# Altium project CPU.PrjPcb (part 1 of 2)
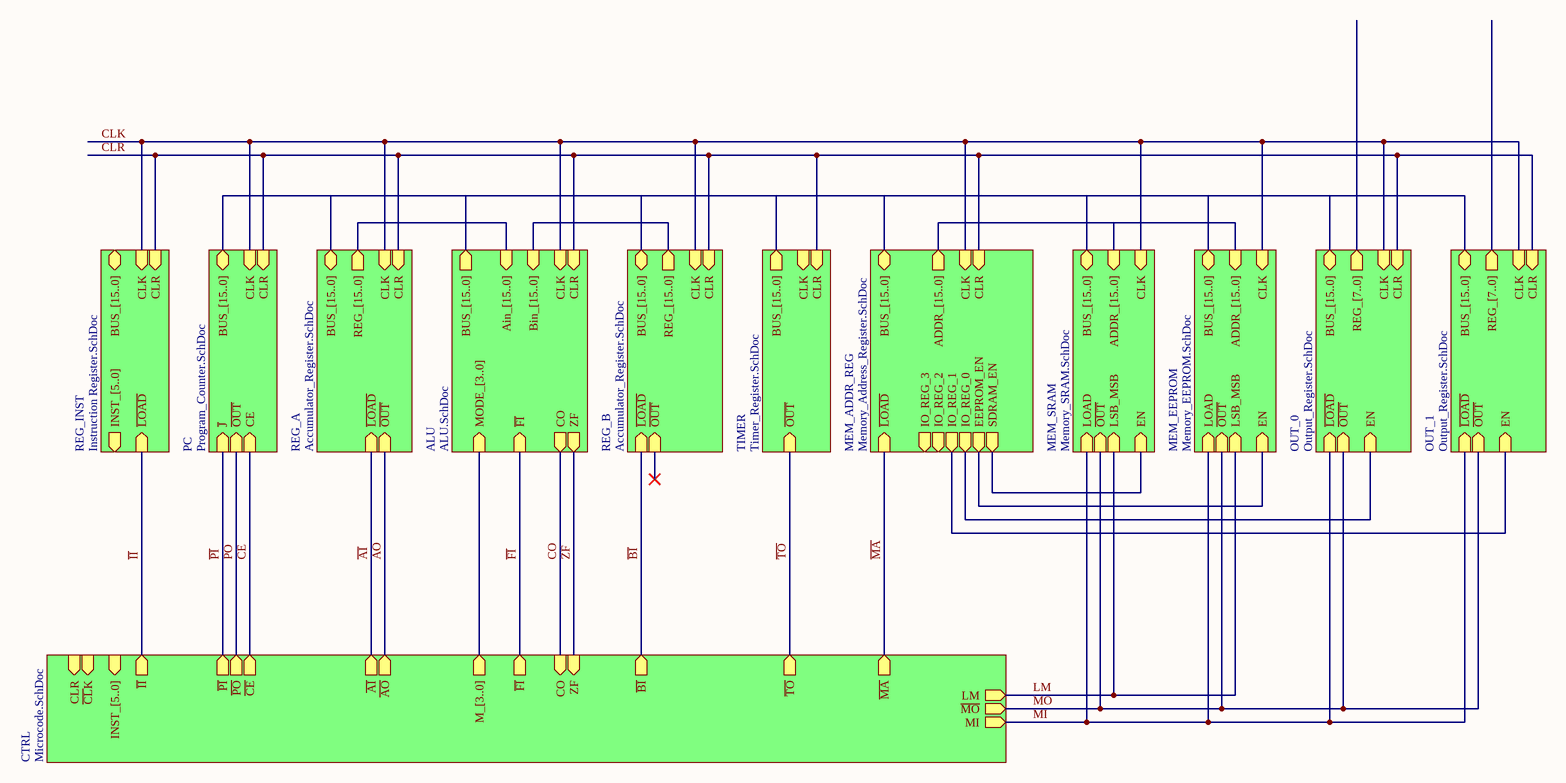
[diagram p0: TOP.SchDoc]
11 sheets, 67 parts. Net scope: hierarchical (ports join the sheet entries above them; power ports are global).
Board file: PCB1.PcbDoc
Sheets:
  TOP.SchDoc
    REG_A = Accumulator_Register.SchDoc
    REG_B = Accumulator_Register.SchDoc
    ALU = ALU.SchDoc
      ALU_ADDER = ALU_Adder.SchDoc
      ALU_AND = ALU_AND.SchDoc
      ALU_OR = ALU_OR.SchDoc
      ALU_XOR = ALU_XOR.SchDoc
      ALU_SHIFTER = ALU_Shifter.SchDoc
      ALU_ZF = ALU_ZF.SchDoc
      ALU_ONES = ALU_ONES.SchDoc
    TIMER = Timer_Register.SchDoc

## Sheet TOP.SchDoc
size B; Author: E. Sims; Organization: Let's Build Rockets Inc.; SheetNumber: 1; SheetTotal: 16

### Sub-sheets
ALU = ALU.SchDoc: MODE_[3..0] (in), BUS_[15..0] (out), Ain_[15..0] (in), Bin_[15..0] (in), CO (out), CLK (in), ~{FI} (in), ZF (out), CLR (in)
CTRL = Microcode.SchDoc (file not in this document): ~{AO} (out), ~{CE} (out), MI (out), ~{MA} (out), ~{FI} (out), ~{PI} (out), ~{AI} (out), ~{II} (out), CLR (in), ~{PO} (out), LM (out), ~{MO} (out), ~{TO} (out), INST_[5..0] (in), ~{CL}K (in), ~{BI} (out), M_[3..0] (out), ZF (in), CO (in)
MEM_ADDR_REG = Memory_Address_Register.SchDoc (file not in this document): CLK (in), CLR (in), ~{LOAD} (in), BUS_[15..0] (bidir), ADDR_[15..0] (out), EEPROM_EN (out), SDRAM_EN (out), IO_REG_2 (out), IO_REG_3 (out), IO_REG_1 (out), IO_REG_0 (out)
MEM_EEPROM = Memory_EEPROM.SchDoc (file not in this document): CLK (in), BUS_[15..0] (bidir), ADDR_[15..0] (in), LOAD (in), LSB_MSB (in), ~{OUT} (in), EN (in)
MEM_SRAM = Memory_SRAM.SchDoc (file not in this document): CLK (in), BUS_[15..0] (bidir), ADDR_[15..0] (in), LOAD (in), LSB_MSB (in), ~{OUT} (in), EN (in)
OUT_0 = Output_Register.SchDoc (file not in this document): ~{LOAD} (in), CLR (in), BUS_[15..0] (bidir), ~{OUT} (in), CLK (in), REG_[7..0] (out), EN (in)
OUT_1 = Output_Register.SchDoc (file not in this document): ~{LOAD} (in), CLR (in), BUS_[15..0] (bidir), ~{OUT} (in), CLK (in), REG_[7..0] (out), EN (in)
PC = Program_Counter.SchDoc (file not in this document): CLK (in), ~{OUT} (in), CLR (in), BUS_[15..0] (bidir), CE (in), ~{J} (in)
REG_A = Accumulator_Register.SchDoc: CLK (in), ~{OUT} (in), CLR (in), ~{LOAD} (in), BUS_[15..0] (bidir), REG_[15..0] (out)
REG_B = Accumulator_Register.SchDoc: CLK (in), ~{OUT} (in), CLR (in), ~{LOAD} (in), BUS_[15..0] (bidir), REG_[15..0] (out)
REG_INST = Instruction Register.SchDoc (file not in this document): CLK (in), CLR (in), BUS_[15..0] (bidir), ~{LOAD} (in), INST_[5..0] (out)
TIMER = Timer_Register.SchDoc: CLK (in), ~{OUT} (in), CLR (in), BUS_[15..0] (out)

### Nets
~{AI}: sheet REG_A/~{LOAD}, sheet CTRL/~{AI}
~{AO}: sheet REG_A/~{OUT}, sheet CTRL/~{AO}
~{BI}: sheet REG_B/~{LOAD}, sheet CTRL/~{BI}
~{CE}: sheet PC/CE, sheet CTRL/~{CE}
CLK: sheet REG_A/CLK, sheet REG_B/CLK, sheet PC/CLK, sheet MEM_ADDR_REG/CLK, sheet MEM_SRAM/CLK, sheet MEM_EEPROM/CLK, sheet ALU/CLK, sheet OUT_0/CLK, sheet REG_INST/CLK, sheet OUT_1/CLK
CLR: sheet REG_A/CLR, sheet REG_B/CLR, sheet PC/CLR, sheet MEM_ADDR_REG/CLR, sheet ALU/CLR, sheet OUT_0/CLR, sheet REG_INST/CLR, sheet TIMER/CLR, sheet OUT_1/CLR
CO: sheet ALU/CO, sheet CTRL/CO
~{FI}: sheet ALU/~{FI}, sheet CTRL/~{FI}
~{II}: sheet REG_INST/~{LOAD}, sheet CTRL/~{II}
LM: sheet MEM_SRAM/LSB_MSB, sheet MEM_EEPROM/LSB_MSB, sheet CTRL/LM
~{MA}: sheet MEM_ADDR_REG/~{LOAD}, sheet CTRL/~{MA}
~{MO}: sheet MEM_SRAM/~{OUT}, sheet MEM_EEPROM/~{OUT}, sheet OUT_0/~{OUT}, sheet CTRL/~{MO}, sheet OUT_1/~{OUT}
MI: sheet MEM_SRAM/LOAD, sheet MEM_EEPROM/LOAD, sheet OUT_0/~{LOAD}, sheet CTRL/MI, sheet OUT_1/~{LOAD}
~{PI}: sheet PC/~{J}, sheet CTRL/~{PI}
~{PO}: sheet PC/~{OUT}, sheet CTRL/~{PO}
~{TO}: sheet CTRL/~{TO}, sheet TIMER/~{OUT}  [project net ~{OUT}]
ZF: sheet ALU/ZF, sheet CTRL/ZF
(unnamed): sheet MEM_ADDR_REG/EEPROM_EN, sheet MEM_EEPROM/EN
(unnamed): sheet MEM_ADDR_REG/SDRAM_EN, sheet MEM_SRAM/EN
(unnamed): sheet MEM_ADDR_REG/IO_REG_1, sheet OUT_1/EN
(unnamed): sheet MEM_ADDR_REG/IO_REG_0, sheet OUT_0/EN

### Buses and harness runs
bus sheet ALU/Ain_[15..0] = sheet REG_A/REG_[15..0]
bus sheet ALU/Bin_[15..0] = sheet REG_B/REG_[15..0]
bus sheet ALU/BUS_[15..0] = sheet MEM_ADDR_REG/BUS_[15..0] = sheet MEM_EEPROM/BUS_[15..0] = sheet MEM_SRAM/BUS_[15..0] = sheet OUT_0/BUS_[15..0] = sheet OUT_1/BUS_[15..0] = sheet PC/BUS_[15..0] = sheet REG_A/BUS_[15..0] = sheet REG_B/BUS_[15..0] = sheet TIMER/BUS_[15..0]
bus sheet ALU/MODE_[3..0] = sheet CTRL/M_[3..0]
bus sheet MEM_ADDR_REG/ADDR_[15..0] = sheet MEM_EEPROM/ADDR_[15..0] = sheet MEM_SRAM/ADDR_[15..0]

### Notes on the sheet
- Let's Build Rocket's Inc. Modular Paylaod System Based on TMP-010 Rev
  For more information visit https://github.com/LetsBuildRockets/Modular-Payload-System
  This work is licensed under CC BY-NC 4.0. To view a copy of this license, visit https://creativecommons.org/licenses/by-nc/4.0
- Title
- Size:
- Date:
- Assembly Variant:
- B
- Number:
- Time:
- Revision:
- Sheet
- of
- Author:
- File:

## Sheet Accumulator_Register.SchDoc
size B; Author: E. Sims; Organization: Let's Build Rockets Inc.; SheetNumber: 2; SheetTotal: 16
Used 2 times, as channels REG_A, REG_B. Parts and nets are listed once, with the designators drawn on the sheet.
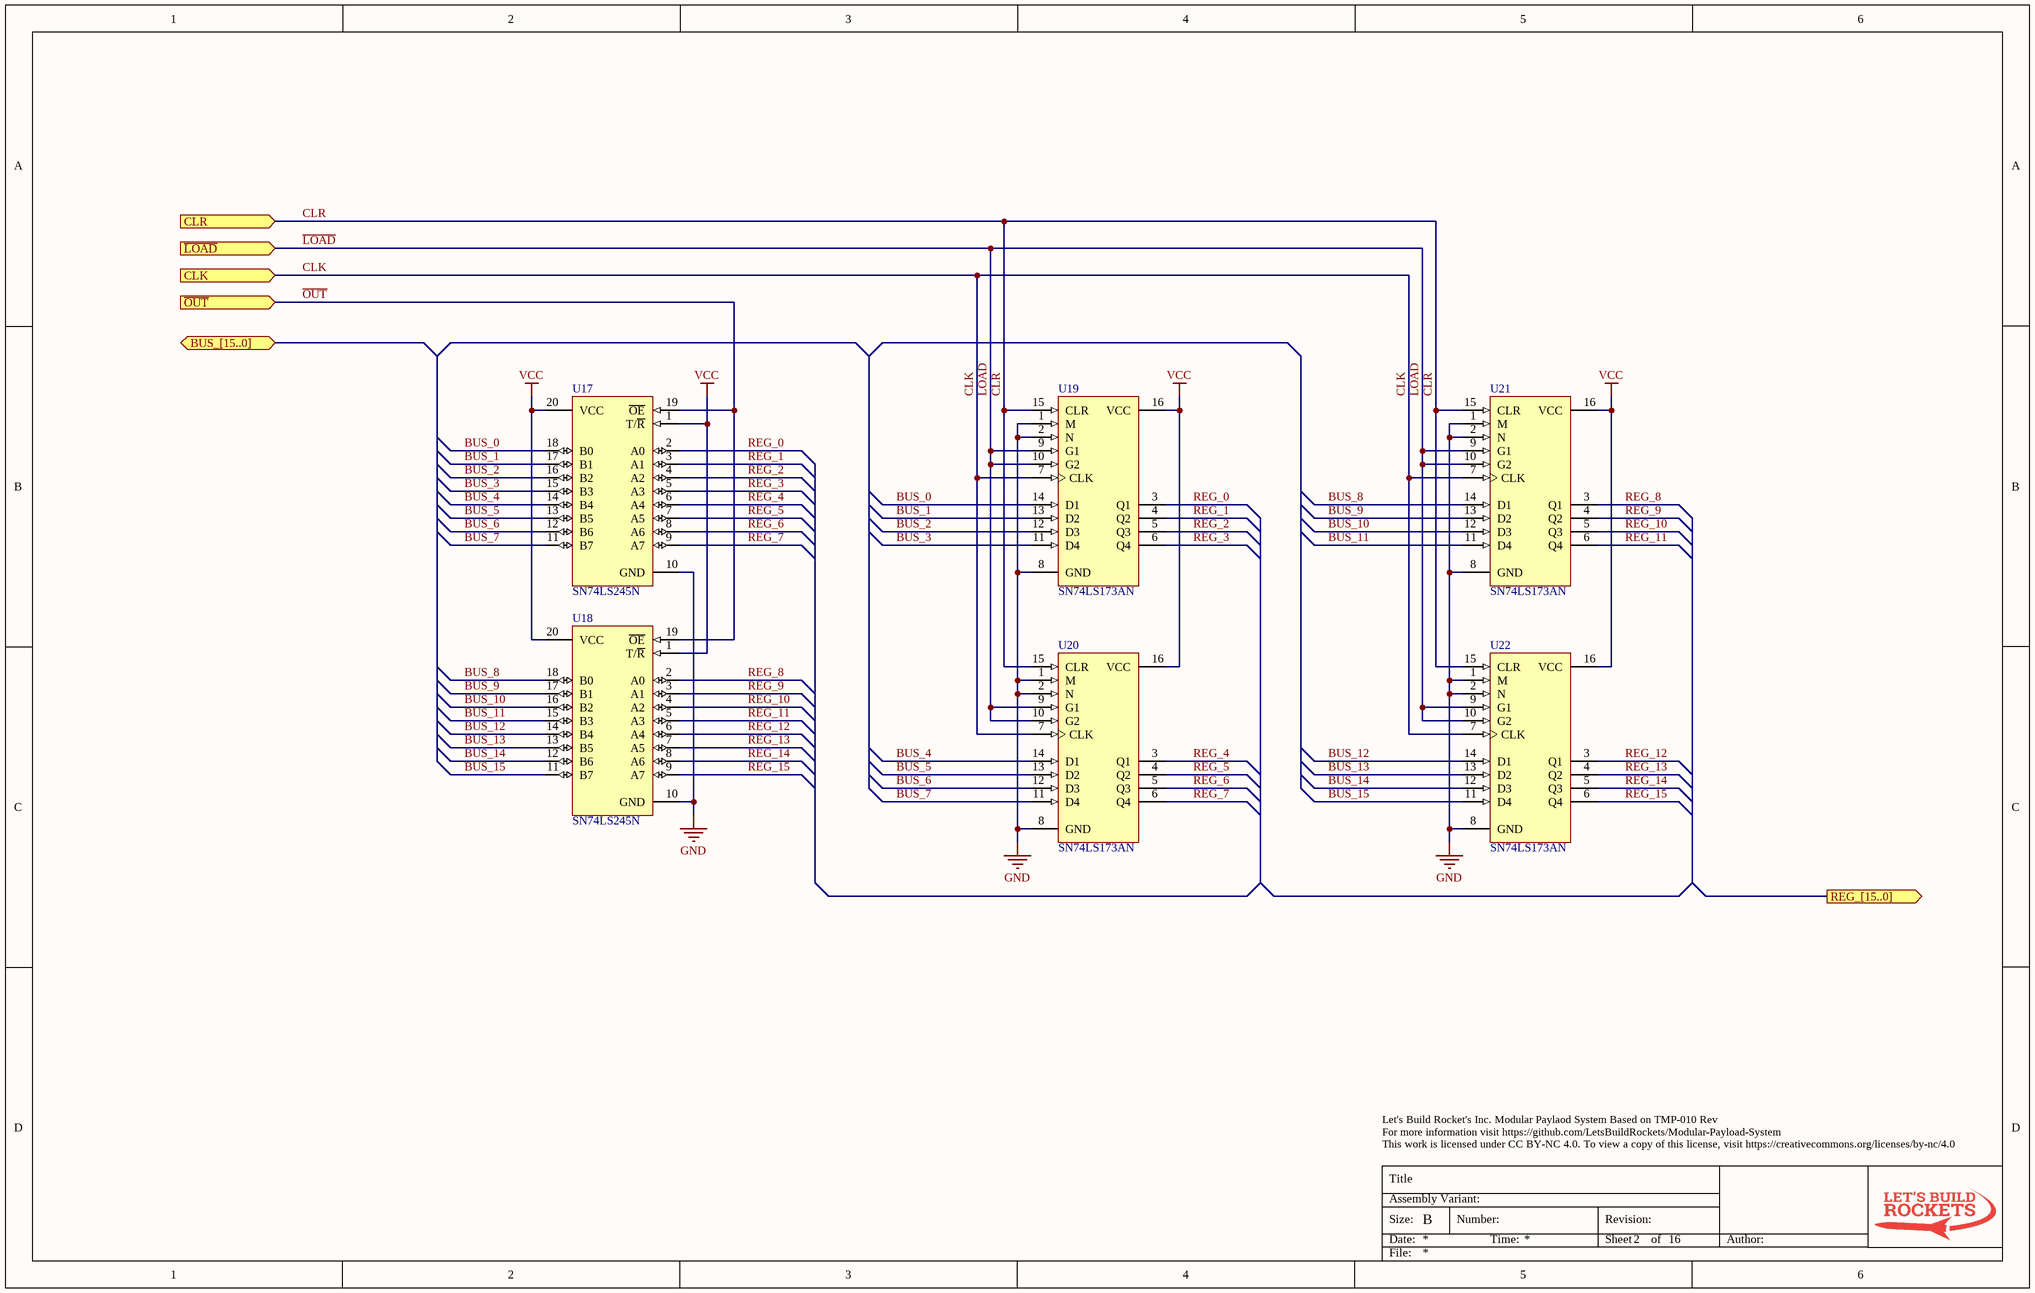
[diagram p1: Accumulator_Register.SchDoc]

### Parts
U17  SN74LS245N  [N020]
U18  SN74LS245N  [N020]
U19  SN74LS173AN  [N016D]
U20  SN74LS173AN  [N016D]
U21  SN74LS173AN  [N016D]
U22  SN74LS173AN  [N016D]

### Ports
BUS_[15..0] (bidir), CLK (in), CLR (in), REG_[15..0] (out), ~{LOAD} (in), ~{OUT} (in)

### Nets
GND: U17.10(GND) U18.10(GND) U19.1(M) U19.2(N) U19.8(GND) U20.1(M) U20.2(N) U20.8(GND) U21.1(M) U21.2(N) U21.8(GND) U22.1(M) U22.2(N) U22.8(GND)
VCC: U17.1(T/~{R}) U17.20(VCC) U18.1(T/~{R}) U18.20(VCC) U19.16(VCC) U20.16(VCC) U21.16(VCC) U22.16(VCC)
BUS_0: U17.18(B0) U19.14(D1)
BUS_1: U17.17(B1) U19.13(D2)
BUS_2: U17.16(B2) U19.12(D3)
BUS_3: U17.15(B3) U19.11(D4)
BUS_4: U17.14(B4) U20.14(D1)
BUS_5: U17.13(B5) U20.13(D2)
BUS_6: U17.12(B6) U20.12(D3)
BUS_7: U17.11(B7) U20.11(D4)
BUS_8: U18.18(B0) U21.14(D1)
BUS_9: U18.17(B1) U21.13(D2)
BUS_10: U18.16(B2) U21.12(D3)
BUS_11: U18.15(B3) U21.11(D4)
BUS_12: U18.14(B4) U22.14(D1)
BUS_13: U18.13(B5) U22.13(D2)
BUS_14: U18.12(B6) U22.12(D3)
BUS_15: U18.11(B7) U22.11(D4)
CLK: U19.7(CLK) U20.7(CLK) U21.7(CLK) U22.7(CLK) ; port CLK
CLR: U19.15(CLR) U20.15(CLR) U21.15(CLR) U22.15(CLR) ; port CLR
~{LOAD}: U19.9(G1) U19.10(G2) U20.9(G1) U20.10(G2) U21.9(G1) U21.10(G2) U22.9(G1) U22.10(G2) ; port ~{LOAD}
~{OUT}: U17.19(~{OE}) U18.19(~{OE}) ; port ~{OUT}
REG_0: U17.2(A0) U19.3(Q1)
REG_1: U17.3(A1) U19.4(Q2)
REG_2: U17.4(A2) U19.5(Q3)
REG_3: U17.5(A3) U19.6(Q4)
REG_4: U17.6(A4) U20.3(Q1)
REG_5: U17.7(A5) U20.4(Q2)
REG_6: U17.8(A6) U20.5(Q3)
REG_7: U17.9(A7) U20.6(Q4)
REG_8: U18.2(A0) U21.3(Q1)
REG_9: U18.3(A1) U21.4(Q2)
REG_10: U18.4(A2) U21.5(Q3)
REG_11: U18.5(A3) U21.6(Q4)
REG_12: U18.6(A4) U22.3(Q1)
REG_13: U18.7(A5) U22.4(Q2)
REG_14: U18.8(A6) U22.5(Q3)
REG_15: U18.9(A7) U22.6(Q4)

### Channels
REG_A: designators end in _REG_A; ports CLK=CLK CLR=CLR ~{LOAD}=~{AI} ~{OUT}=~{AO}
REG_B: designators end in _REG_B; ports CLK=CLK CLR=CLR ~{LOAD}=~{BI} ~{OUT}=~{OUT}_REG_B

### Notes on the sheet
- Let's Build Rocket's Inc. Modular Paylaod System Based on TMP-010 Rev
  For more information visit https://github.com/LetsBuildRockets/Modular-Payload-System
  This work is licensed under CC BY-NC 4.0. To view a copy of this license, visit https://creativecommons.org/licenses/by-nc/4.0
- Title
- Size:
- Date:
- Assembly Variant:
- B
- Number:
- Time:
- Revision:
- Sheet
- of
- Author:
- File:

### Library data of the parts
U17 U18 = SN74LS245N: Octal Bus Transceiver with 3-State Outputs; Published: 8-Jun-2000; LatestRevisionDate: 04-Mar-2005; LatestRevisionNote: Stylized 3D Model Added.; DatasheetVersion: Mar-1988; PackageVersion: Oct-1995; PackageReference: N020; Publisher: Altium Limited; PackageDescription: DIP; 20 Leads; Row Spacing 7.62 mm; Pitch 2.54 mm; ComponentLink1Description: Manufacturer Link; ComponentLink1URL: http://www.ti.com/; ComponentLink2Description: Datasheet; ComponentLink2URL: http://www-s.ti.com/sc/ds/sn74ls245.pdf
U19-U22 = SN74LS173AN: 4-Bit D-Type Register with 3-State Outputs; Published: 8-Jun-2000; LatestRevisionDate: 04-Mar-2005; LatestRevisionNote: Stylized 3D Model Added.; DatasheetVersion: Mar-1988; PackageVersion: Oct-1995; PackageReference: N016D; Publisher: Altium Limited; PackageDescription: DIP; 16 Leads; Row Spacing 7.62 mm; Pitch 2.54 mm; Code_JEDEC: MS-001-BB; ComponentLink1Description: Manufacturer Link; ComponentLink1URL: http://www.ti.com/; ComponentLink2Description: Datasheet; ComponentLink2URL: http://www-s.ti.com/sc/ds/sn74ls173a.pdf

## Sheet ALU.SchDoc
size B; Author: E. Sims; Organization: Let's Build Rockets Inc.; SheetNumber: 4; SheetTotal: 11
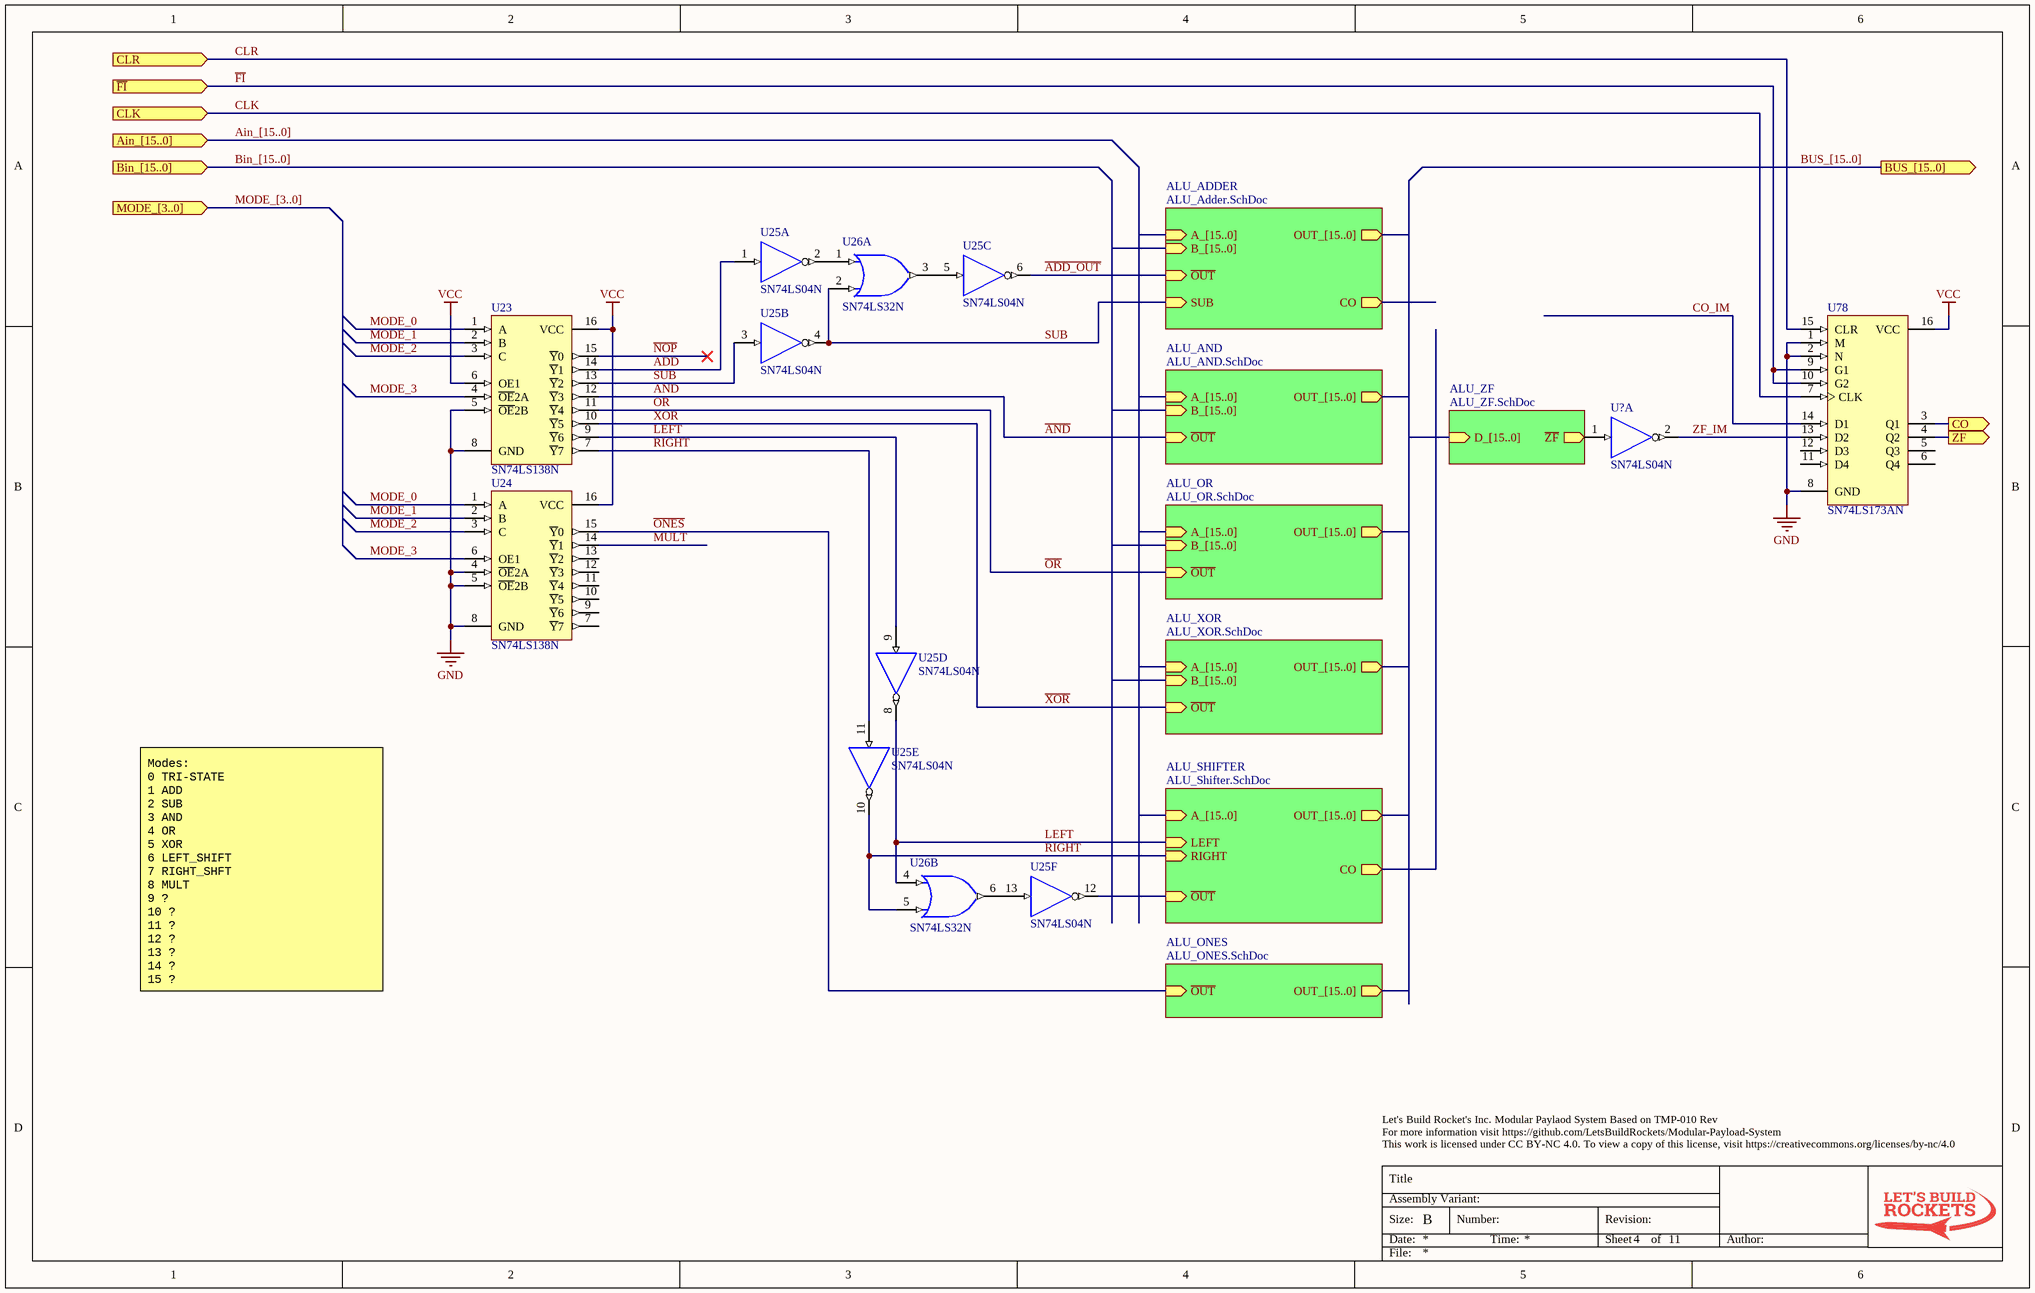
[diagram p2: ALU.SchDoc]

### Parts
(Parts that share a designator on the sheet are numbered #1, #2 ... from top to bottom, then left to right.)
U23  SN74LS138N  [N016]
U24  SN74LS138N  [N016]
U25#1  SN74LS04N  [N014]  (parts A,B,C,D,E,F of 6)
U25#2  SN74LS04N  [N014]  (part A of 6)
U26  SN74LS32N  [N014]  (parts A,B of 4)
U78  SN74LS173AN  [N016D]

### Sub-sheets
ALU_ADDER = ALU_Adder.SchDoc: B_[15..0] (in), ~{OUT} (in), OUT_[15..0] (out), SUB (in), A_[15..0] (in), CO (out)
ALU_AND = ALU_AND.SchDoc: B_[15..0] (in), ~{OUT} (in), OUT_[15..0] (out), A_[15..0] (in)
ALU_ONES = ALU_ONES.SchDoc: ~{OUT} (in), OUT_[15..0] (out)
ALU_OR = ALU_OR.SchDoc: B_[15..0] (in), ~{OUT} (in), OUT_[15..0] (out), A_[15..0] (in)
ALU_SHIFTER = ALU_Shifter.SchDoc: ~{OUT} (in), OUT_[15..0] (out), A_[15..0] (in), CO (out), LEFT (in), RIGHT (in)
ALU_XOR = ALU_XOR.SchDoc: B_[15..0] (in), ~{OUT} (in), OUT_[15..0] (out), A_[15..0] (in)
ALU_ZF = ALU_ZF.SchDoc: D_[15..0] (in), ~{ZF} (out)

### Ports
Ain_[15..0] (in), Bin_[15..0] (in), BUS_[15..0] (out), CLK (in), CLR (in), CO (out), MODE_[3..0] (in), ZF (out), ~{FI} (in)

### Nets
GND: U23.5(~{OE}2B) U23.8(GND) U24.4(~{OE}2A) U24.5(~{OE}2B) U24.8(GND) U25#1.7(GND) U25#2.7(GND) U26.7(GND) U78.1(M) U78.2(N) U78.8(GND)
VCC: U23.6(OE1) U23.16(VCC) U24.16(VCC) U25#1.14(VCC) U25#2.14(VCC) U26.14(VCC) U78.16(VCC)
~{ADD}: U23.14(~{Y}1) U25#1.1(A)
~{ADD_OUT}: U25#1.6(Y) ; sheet ALU_ADDER/~{OUT}
~{AND}: U23.12(~{Y}3) ; sheet ALU_AND/~{OUT}
CLK: U78.7(CLK) ; port CLK
CLR: U78.15(CLR) ; port CLR
CO: U78.3(Q1) ; port CO
CO_IM: U78.14(D1)
~{FI}: U78.9(G1) U78.10(G2) ; port ~{FI}
~{LEFT}: U23.9(~{Y}6) U25#1.9(A)
LEFT: U25#1.8(Y) U26.4(A) ; sheet ALU_SHIFTER/LEFT
~{MULT}: U24.14(~{Y}1)
MODE_0: U23.1(A) U24.1(A)
MODE_1: U23.2(B) U24.2(B)
MODE_2: U23.3(C) U24.3(C)
MODE_3: U23.4(~{OE}2A) U24.6(OE1)
~{NOP}: U23.15(~{Y}0)
~{ONES}: U24.15(~{Y}0) ; sheet ALU_ONES/~{OUT}
~{OR}: U23.11(~{Y}4) ; sheet ALU_OR/~{OUT}
~{OUT}: U25#1.12(Y) ; sheet ALU_SHIFTER/~{OUT}
~{RIGH}T: U23.7(~{Y}7) U25#1.11(A)
RIGHT: U25#1.10(Y) U26.5(B) ; sheet ALU_SHIFTER/RIGHT
~{SUB}: U23.13(~{Y}2) U25#1.3(A)
SUB: U25#1.4(Y) U26.2(B) ; sheet ALU_ADDER/SUB
~{XOR}: U23.10(~{Y}5) ; sheet ALU_XOR/~{OUT}  [project net ~{OUT}]
ZF: U78.4(Q2) ; port ZF
ZF_IM: U25#2.2(Y) U78.13(D2)
NetU25#1_2: U25#1.2(Y) U26.1(A)
NetU25#1_5: U25#1.5(A) U26.3(Y)
NetU25#1_13: U25#1.13(A) U26.6(Y)
NetU25#2_1: U25#2.1(A) ; sheet ALU_ZF/~{ZF}

Not connected (* = marked no-connect by the designer): U24 7(~{Y}7) 9(~{Y}6) 10(~{Y}5) 11(~{Y}4) 12(~{Y}3) 13(~{Y}2); U78 5(Q3) 6(Q4) 11(D4) 12(D3)

### Buses and harness runs
bus Ain_[15..0] = port Ain_[15..0] = sheet ALU_ADDER/A_[15..0] = sheet ALU_AND/A_[15..0] = sheet ALU_OR/A_[15..0] = sheet ALU_SHIFTER/A_[15..0] = sheet ALU_XOR/A_[15..0]
bus Bin_[15..0] = port Bin_[15..0] = sheet ALU_ADDER/B_[15..0] = sheet ALU_AND/B_[15..0] = sheet ALU_OR/B_[15..0] = sheet ALU_XOR/B_[15..0]
bus BUS_[15..0] = port BUS_[15..0] = sheet ALU_ADDER/OUT_[15..0] = sheet ALU_AND/OUT_[15..0] = sheet ALU_ONES/OUT_[15..0] = sheet ALU_OR/OUT_[15..0] = sheet ALU_SHIFTER/OUT_[15..0] = sheet ALU_XOR/OUT_[15..0] = sheet ALU_ZF/D_[15..0]
bus MODE_[3..0] = port MODE_[3..0]

### Notes on the sheet
- Modes:
  0 TRI-STATE
  1 ADD
  2 SUB
  3 AND
  4 OR
  5 XOR
  6 LEFT_SHIFT
  7 RIGHT_SHFT
  8 MULT
  9 ?
  10 ?
  11 ?
  12 ?
  13 ?
  14 ?
  15 ?
- Let's Build Rocket's Inc. Modular Paylaod System Based on TMP-010 Rev
  For more information visit https://github.com/LetsBuildRockets/Modular-Payload-System
  This work is licensed under CC BY-NC 4.0. To view a copy of this license, visit https://creativecommons.org/licenses/by-nc/4.0
- Title
- Size:
- Date:
- Assembly Variant:
- B
- Number:
- Time:
- Revision:
- Sheet
- of
- Author:
- File:

### Library data of the parts
U23 U24 = SN74LS138N: 3-Line to 8-Line Decoder / Demultiplexer; Published: 8-Jun-2000; LatestRevisionDate: 04-Mar-2005; LatestRevisionNote: Stylized 3D Model Added.; DatasheetVersion: Mar-1988; PackageVersion: Oct-1995; PackageReference: N016; Publisher: Altium Limited; PackageDescription: DIP; 16 Leads; Row Spacing 7.62 mm; Pitch 2.54 mm; Code_JEDEC: MS-001-BB; ComponentLink1Description: Manufacturer Link; ComponentLink1URL: http://www.ti.com/; ComponentLink2Description: Datasheet; ComponentLink2URL: http://www-s.ti.com/sc/ds/sn74ls138.pdf
U25#1 U25#2 = SN74LS04N: Hex Inverter; Published: 8-Jun-2000; LatestRevisionDate: 04-Mar-2005; LatestRevisionNote: Stylized 3D Model Added.; DatasheetVersion: Mar-1988; PackageVersion: Oct-1995; PackageReference: N014; Publisher: Altium Limited; PackageDescription: DIP; 14 Leads; Row Spacing 7.62 mm; Pitch 2.54 mm; ComponentLink1Description: Manufacturer Link; ComponentLink1URL: http://www.ti.com/; ComponentLink2Description: Datasheet; ComponentLink2URL: http://www-s.ti.com/sc/ds/sn74ls04.pdf
U26 = SN74LS32N: Quadruple 2-Input Positive-OR Gate; Published: 8-Jun-2000; LatestRevisionDate: 04-Mar-2005; LatestRevisionNote: Stylized 3D Model Added.; DatasheetVersion: Mar-1988; PackageVersion: Oct-1995; PackageReference: N014; Publisher: Altium Limited; PackageDescription: DIP; 14 Leads; Row Spacing 7.62 mm; Pitch 2.54 mm; ComponentLink1Description: Manufacturer Link; ComponentLink1URL: http://www.ti.com/; ComponentLink2Description: Datasheet; ComponentLink2URL: http://www-s.ti.com/sc/ds/sn74ls32.pdf
U78 = SN74LS173AN: as U19 on sheet Accumulator_Register; Published: 8-Jun-2000; LatestRevisionDate: 04-Mar-2005; LatestRevisionNote: Stylized 3D Model Added.; DatasheetVersion: Mar-1988; PackageVersion: Oct-1995; PackageReference: N016D; Publisher: Altium Limited; PackageDescription: DIP; 16 Leads; Row Spacing 7.62 mm; Pitch 2.54 mm; Code_JEDEC: MS-001-BB; ComponentLink1Description: Manufacturer Link; ComponentLink1URL: http://www.ti.com/; ComponentLink2Description: Datasheet; ComponentLink2URL: http://www-s.ti.com/sc/ds/sn74ls173a.pdf

## Sheet ALU_Adder.SchDoc
size B; Author: E. Sims; Organization: Let's Build Rockets Inc.; SheetNumber: 18; SheetTotal: 18
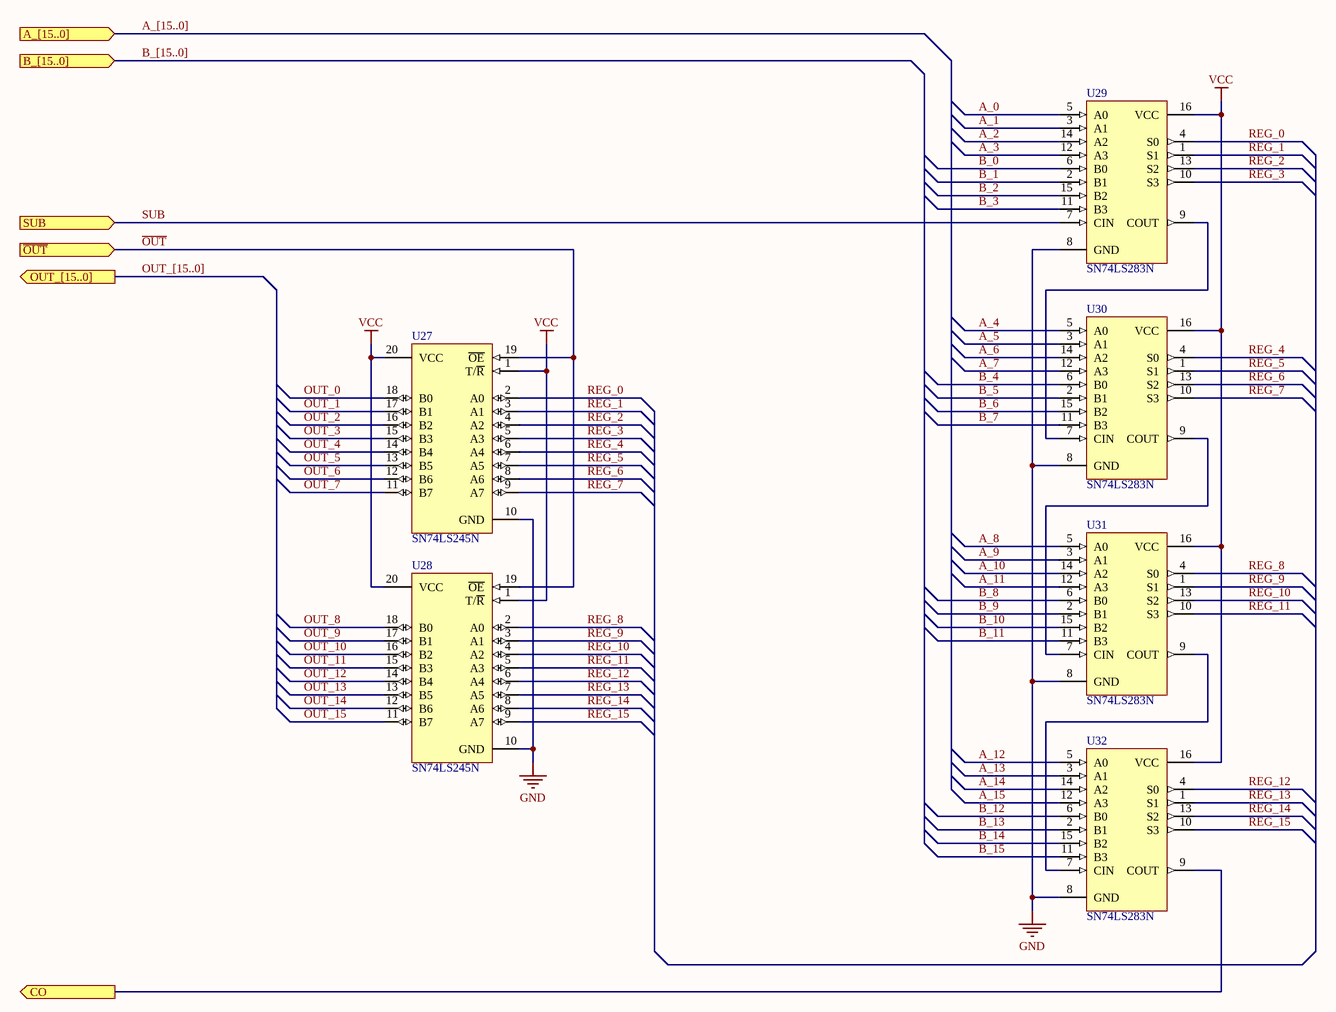
[diagram p3: ALU_Adder.SchDoc]

### Parts
U27  SN74LS245N  [N020]
U28  SN74LS245N  [N020]
U29  SN74LS283N  [W016]
U30  SN74LS283N  [W016]
U31  SN74LS283N  [W016]
U32  SN74LS283N  [W016]

### Ports
A_[15..0] (in), B_[15..0] (in), CO (out), OUT_[15..0] (out), SUB (in), ~{OUT} (in)

### Nets
GND: U27.10(GND) U28.10(GND) U29.8(GND) U30.8(GND) U31.8(GND) U32.8(GND)
VCC: U27.1(T/~{R}) U27.20(VCC) U28.1(T/~{R}) U28.20(VCC) U29.16(VCC) U30.16(VCC) U31.16(VCC) U32.16(VCC)
A_0: U29.5(A0)
A_1: U29.3(A1)
A_2: U29.14(A2)
A_3: U29.12(A3)
A_4: U30.5(A0)
A_5: U30.3(A1)
A_6: U30.14(A2)
A_7: U30.12(A3)
A_8: U31.5(A0)
A_9: U31.3(A1)
A_10: U31.14(A2)
A_11: U31.12(A3)
A_12: U32.5(A0)
A_13: U32.3(A1)
A_14: U32.14(A2)
A_15: U32.12(A3)
B_0: U29.6(B0)
B_1: U29.2(B1)
B_2: U29.15(B2)
B_3: U29.11(B3)
B_4: U30.6(B0)
B_5: U30.2(B1)
B_6: U30.15(B2)
B_7: U30.11(B3)
B_8: U31.6(B0)
B_9: U31.2(B1)
B_10: U31.15(B2)
B_11: U31.11(B3)
B_12: U32.6(B0)
B_13: U32.2(B1)
B_14: U32.15(B2)
B_15: U32.11(B3)
~{OUT}: U27.19(~{OE}) U28.19(~{OE}) ; port ~{OUT}  [project net ~{ADD_OUT}]
OUT_0: U27.18(B0)  [project net BUS_0]
OUT_1: U27.17(B1)  [project net BUS_1]
OUT_2: U27.16(B2)  [project net BUS_2]
OUT_3: U27.15(B3)  [project net BUS_3]
OUT_4: U27.14(B4)  [project net BUS_4]
OUT_5: U27.13(B5)  [project net BUS_5]
OUT_6: U27.12(B6)  [project net BUS_6]
OUT_7: U27.11(B7)  [project net BUS_7]
OUT_8: U28.18(B0)  [project net BUS_8]
OUT_9: U28.17(B1)  [project net BUS_9]
OUT_10: U28.16(B2)  [project net BUS_10]
OUT_11: U28.15(B3)  [project net BUS_11]
OUT_12: U28.14(B4)  [project net BUS_12]
OUT_13: U28.13(B5)  [project net BUS_13]
OUT_14: U28.12(B6)  [project net BUS_14]
OUT_15: U28.11(B7)  [project net BUS_15]
REG_0: U27.2(A0) U29.4(S0)
REG_1: U27.3(A1) U29.1(S1)
REG_2: U27.4(A2) U29.13(S2)
REG_3: U27.5(A3) U29.10(S3)
REG_4: U27.6(A4) U30.4(S0)
REG_5: U27.7(A5) U30.1(S1)
REG_6: U27.8(A6) U30.13(S2)
REG_7: U27.9(A7) U30.10(S3)
REG_8: U28.2(A0) U31.4(S0)
REG_9: U28.3(A1) U31.1(S1)
REG_10: U28.4(A2) U31.13(S2)
REG_11: U28.5(A3) U31.10(S3)
REG_12: U28.6(A4) U32.4(S0)
REG_13: U28.7(A5) U32.1(S1)
REG_14: U28.8(A6) U32.13(S2)
REG_15: U28.9(A7) U32.10(S3)
SUB: U29.7(CIN) ; port SUB
NetU29_9: U29.9(COUT) U30.7(CIN)
NetU30_9: U30.9(COUT) U31.7(CIN)
NetU31_9: U31.9(COUT) U32.7(CIN)
NetU32_9: U32.9(COUT) ; port CO

### Buses and harness runs
bus A_[15..0] = port A_[15..0]
bus B_[15..0] = port B_[15..0]
bus OUT_[15..0] = port OUT_[15..0]

### Notes on the sheet
- Let's Build Rocket's Inc. Modular Paylaod System Based on TMP-010 Rev
  For more information visit https://github.com/LetsBuildRockets/Modular-Payload-System
  This work is licensed under CC BY-NC 4.0. To view a copy of this license, visit https://creativecommons.org/licenses/by-nc/4.0
- Title
- Size:
- Date:
- Assembly Variant:
- B
- Number:
- Time:
- Revision:
- Sheet
- of
- Author:
- File:

### Library data of the parts
U27 U28 = SN74LS245N: as U17 on sheet Accumulator_Register; Published: 8-Jun-2000; LatestRevisionDate: 04-Mar-2005; LatestRevisionNote: Stylized 3D Model Added.; DatasheetVersion: Mar-1988; PackageVersion: Oct-1995; PackageReference: N020; Publisher: Altium Limited; PackageDescription: DIP; 20 Leads; Row Spacing 7.62 mm; Pitch 2.54 mm; ComponentLink1Description: Manufacturer Link; ComponentLink1URL: http://www.ti.com/; ComponentLink2Description: Datasheet; ComponentLink2URL: http://www-s.ti.com/sc/ds/sn74ls245.pdf
U29-U32 = SN74LS283N: 4-Bit Binary Full Adder with Fast Carry; Published: 8-Jun-2000; LatestRevisionDate: 04-Mar-2005; LatestRevisionNote: Stylized 3D Model Added.; DatasheetVersion: Mar-1988; PackageVersion: Jan-1995; PackageReference: W016; Publisher: Altium Limited; PackageDescription: DFP; 16 Leads; Body 10.9 x 7.2 mm (LxW max); Pitch 1.27 mm; ComponentLink1Description: Manufacturer Link; ComponentLink1URL: http://www.ti.com; ComponentLink2Description: Datasheet; ComponentLink2URL: http://www-s.ti.com/sc/ds/sn54ls283.pdf; Code_JEDEC: MO-092-AC

## Sheet ALU_AND.SchDoc
size B; Author: E. Sims; Organization: Let's Build Rockets Inc.; SheetNumber: 12; SheetTotal: 16
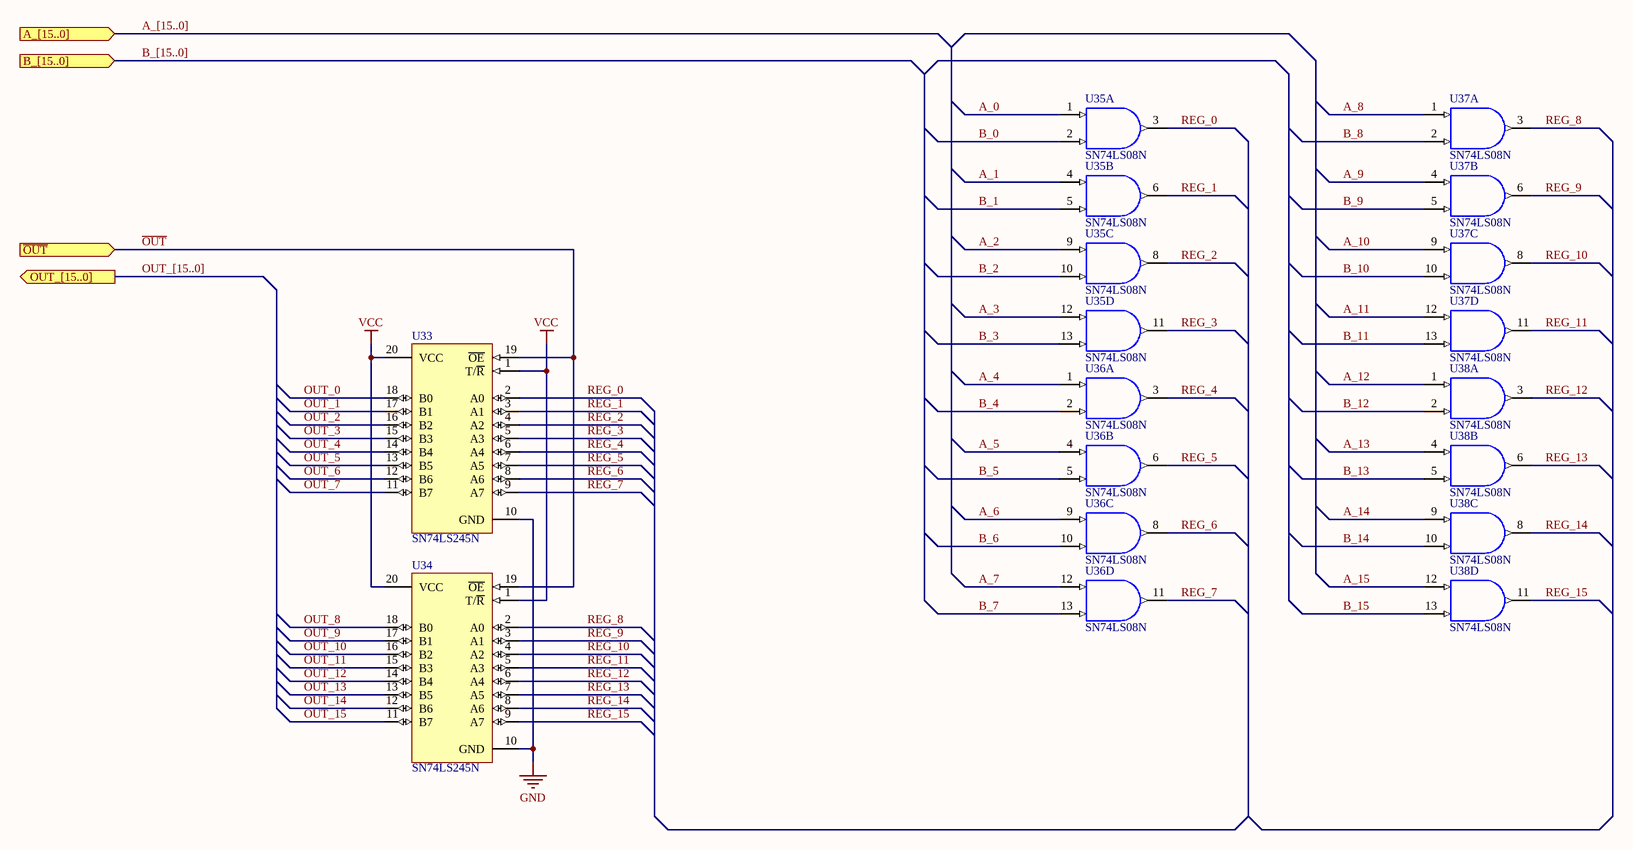
[diagram p4: ALU_AND.SchDoc]

### Parts
U33  SN74LS245N  [N020]
U34  SN74LS245N  [N020]
U35  SN74LS08N  [N014]  (parts A,B,C,D of 4)
U36  SN74LS08N  [N014]  (parts A,B,C,D of 4)
U37  SN74LS08N  [N014]  (parts A,B,C,D of 4)
U38  SN74LS08N  [N014]  (parts A,B,C,D of 4)

### Ports
A_[15..0] (in), B_[15..0] (in), OUT_[15..0] (out), ~{OUT} (in)

### Nets
GND: U33.10(GND) U34.10(GND) U35.7(GND) U36.7(GND) U37.7(GND) U38.7(GND)
VCC: U33.1(T/~{R}) U33.20(VCC) U34.1(T/~{R}) U34.20(VCC) U35.14(VCC) U36.14(VCC) U37.14(VCC) U38.14(VCC)
A_0: U35.1(A)
A_1: U35.4(A)
A_2: U35.9(A)
A_3: U35.12(A)
A_4: U36.1(A)
A_5: U36.4(A)
A_6: U36.9(A)
A_7: U36.12(A)
A_8: U37.1(A)
A_9: U37.4(A)
A_10: U37.9(A)
A_11: U37.12(A)
A_12: U38.1(A)
A_13: U38.4(A)
A_14: U38.9(A)
A_15: U38.12(A)
B_0: U35.2(B)
B_1: U35.5(B)
B_2: U35.10(B)
B_3: U35.13(B)
B_4: U36.2(B)
B_5: U36.5(B)
B_6: U36.10(B)
B_7: U36.13(B)
B_8: U37.2(B)
B_9: U37.5(B)
B_10: U37.10(B)
B_11: U37.13(B)
B_12: U38.2(B)
B_13: U38.5(B)
B_14: U38.10(B)
B_15: U38.13(B)
~{OUT}: U33.19(~{OE}) U34.19(~{OE}) ; port ~{OUT}  [project net ~{AND}]
OUT_0: U33.18(B0)  [project net BUS_0]
OUT_1: U33.17(B1)  [project net BUS_1]
OUT_2: U33.16(B2)  [project net BUS_2]
OUT_3: U33.15(B3)  [project net BUS_3]
OUT_4: U33.14(B4)  [project net BUS_4]
OUT_5: U33.13(B5)  [project net BUS_5]
OUT_6: U33.12(B6)  [project net BUS_6]
OUT_7: U33.11(B7)  [project net BUS_7]
OUT_8: U34.18(B0)  [project net BUS_8]
OUT_9: U34.17(B1)  [project net BUS_9]
OUT_10: U34.16(B2)  [project net BUS_10]
OUT_11: U34.15(B3)  [project net BUS_11]
OUT_12: U34.14(B4)  [project net BUS_12]
OUT_13: U34.13(B5)  [project net BUS_13]
OUT_14: U34.12(B6)  [project net BUS_14]
OUT_15: U34.11(B7)  [project net BUS_15]
REG_0: U33.2(A0) U35.3(Y)
REG_1: U33.3(A1) U35.6(Y)
REG_2: U33.4(A2) U35.8(Y)
REG_3: U33.5(A3) U35.11(Y)
REG_4: U33.6(A4) U36.3(Y)
REG_5: U33.7(A5) U36.6(Y)
REG_6: U33.8(A6) U36.8(Y)
REG_7: U33.9(A7) U36.11(Y)
REG_8: U34.2(A0) U37.3(Y)
REG_9: U34.3(A1) U37.6(Y)
REG_10: U34.4(A2) U37.8(Y)
REG_11: U34.5(A3) U37.11(Y)
REG_12: U34.6(A4) U38.3(Y)
REG_13: U34.7(A5) U38.6(Y)
REG_14: U34.8(A6) U38.8(Y)
REG_15: U34.9(A7) U38.11(Y)

### Buses and harness runs
bus A_[15..0] = port A_[15..0]
bus B_[15..0] = port B_[15..0]
bus OUT_[15..0] = port OUT_[15..0]

### Notes on the sheet
- Let's Build Rocket's Inc. Modular Paylaod System Based on TMP-010 Rev
  For more information visit https://github.com/LetsBuildRockets/Modular-Payload-System
  This work is licensed under CC BY-NC 4.0. To view a copy of this license, visit https://creativecommons.org/licenses/by-nc/4.0
- Title
- Size:
- Date:
- Assembly Variant:
- B
- Number:
- Time:
- Revision:
- Sheet
- of
- Author:
- File:

### Library data of the parts
U33 U34 = SN74LS245N: as U17 on sheet Accumulator_Register; Published: 8-Jun-2000; LatestRevisionDate: 04-Mar-2005; LatestRevisionNote: Stylized 3D Model Added.; DatasheetVersion: Mar-1988; PackageVersion: Oct-1995; PackageReference: N020; Publisher: Altium Limited; PackageDescription: DIP; 20 Leads; Row Spacing 7.62 mm; Pitch 2.54 mm; ComponentLink1Description: Manufacturer Link; ComponentLink1URL: http://www.ti.com/; ComponentLink2Description: Datasheet; ComponentLink2URL: http://www-s.ti.com/sc/ds/sn74ls245.pdf
U35-U38 = SN74LS08N: Quadruple 2-Input Positive-AND Gate; Published: 8-Jun-2000; LatestRevisionDate: 04-Mar-2005; LatestRevisionNote: Stylized 3D Model Added.; DatasheetVersion: Mar-1988; PackageVersion: Oct-1995; PackageReference: N014; Publisher: Altium Limited; PackageDescription: DIP; 14 Leads; Row Spacing 7.62 mm; Pitch 2.54 mm; ComponentLink1Description: Manufacturer Link; ComponentLink1URL: http://www.ti.com/; ComponentLink2Description: Datasheet; ComponentLink2URL: http://www-s.ti.com/sc/ds/SN74LS08.pdf

## Sheet ALU_OR.SchDoc
size B; Author: E. Sims; Organization: Let's Build Rockets Inc.; SheetNumber: 13; SheetTotal: 16
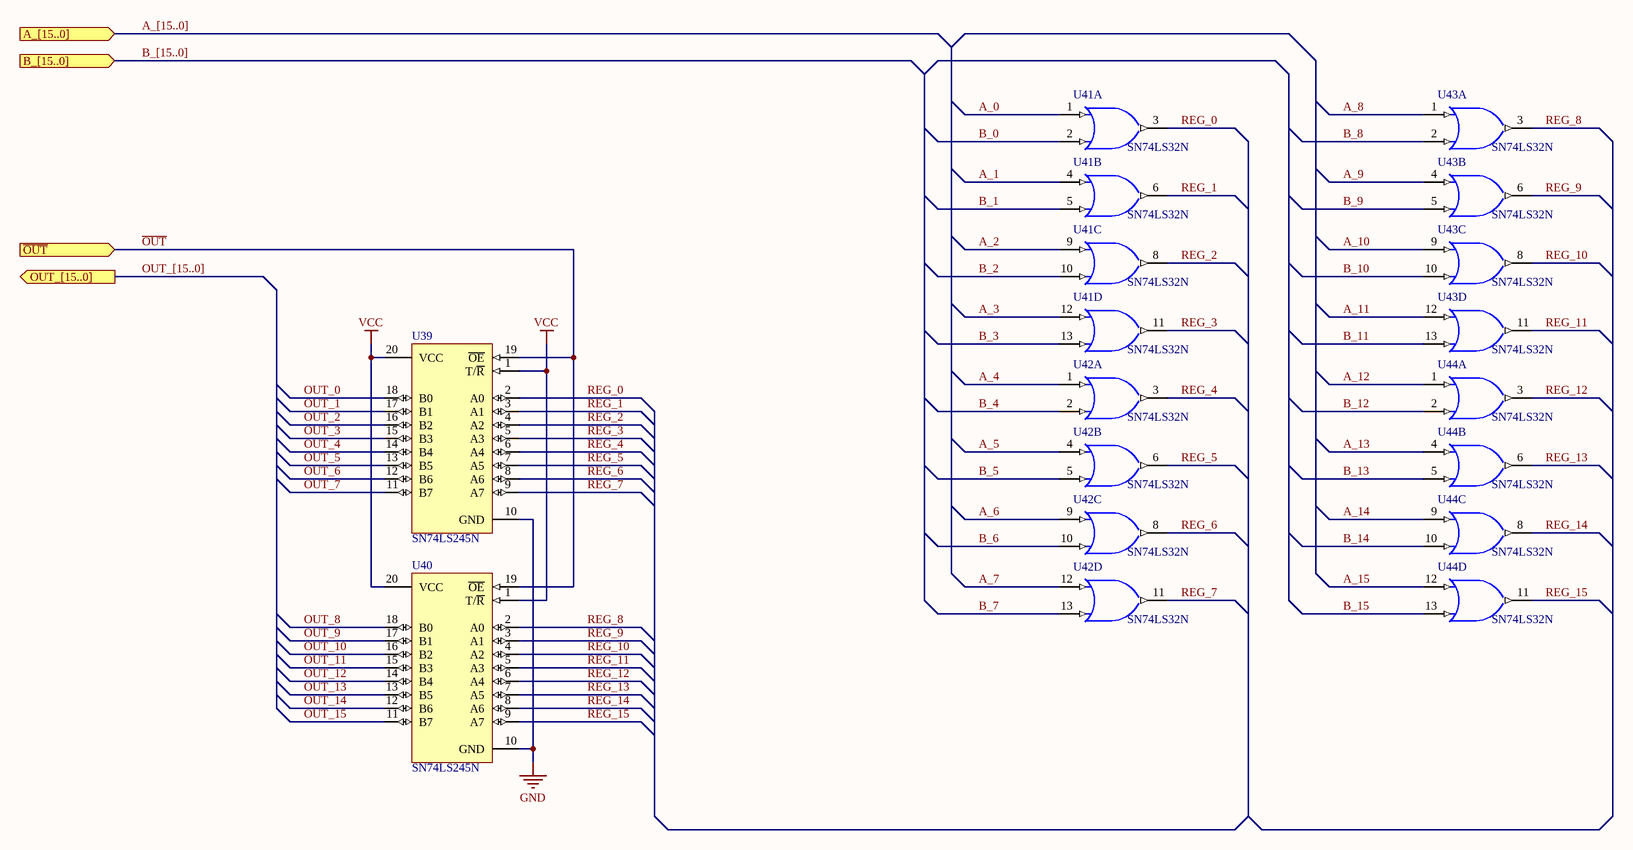
[diagram p5: ALU_OR.SchDoc]

### Parts
U39  SN74LS245N  [N020]
U40  SN74LS245N  [N020]
U41  SN74LS32N  [N014]  (parts A,B,C,D of 4)
U42  SN74LS32N  [N014]  (parts A,B,C,D of 4)
U43  SN74LS32N  [N014]  (parts A,B,C,D of 4)
U44  SN74LS32N  [N014]  (parts A,B,C,D of 4)

### Ports
A_[15..0] (in), B_[15..0] (in), OUT_[15..0] (out), ~{OUT} (in)

### Nets
GND: U39.10(GND) U40.10(GND) U41.7(GND) U42.7(GND) U43.7(GND) U44.7(GND)
VCC: U39.1(T/~{R}) U39.20(VCC) U40.1(T/~{R}) U40.20(VCC) U41.14(VCC) U42.14(VCC) U43.14(VCC) U44.14(VCC)
A_0: U41.1(A)
A_1: U41.4(A)
A_2: U41.9(A)
A_3: U41.12(A)
A_4: U42.1(A)
A_5: U42.4(A)
A_6: U42.9(A)
A_7: U42.12(A)
A_8: U43.1(A)
A_9: U43.4(A)
A_10: U43.9(A)
A_11: U43.12(A)
A_12: U44.1(A)
A_13: U44.4(A)
A_14: U44.9(A)
A_15: U44.12(A)
B_0: U41.2(B)
B_1: U41.5(B)
B_2: U41.10(B)
B_3: U41.13(B)
B_4: U42.2(B)
B_5: U42.5(B)
B_6: U42.10(B)
B_7: U42.13(B)
B_8: U43.2(B)
B_9: U43.5(B)
B_10: U43.10(B)
B_11: U43.13(B)
B_12: U44.2(B)
B_13: U44.5(B)
B_14: U44.10(B)
B_15: U44.13(B)
~{OUT}: U39.19(~{OE}) U40.19(~{OE}) ; port ~{OUT}  [project net ~{OR}]
OUT_0: U39.18(B0)  [project net BUS_0]
OUT_1: U39.17(B1)  [project net BUS_1]
OUT_2: U39.16(B2)  [project net BUS_2]
OUT_3: U39.15(B3)  [project net BUS_3]
OUT_4: U39.14(B4)  [project net BUS_4]
OUT_5: U39.13(B5)  [project net BUS_5]
OUT_6: U39.12(B6)  [project net BUS_6]
OUT_7: U39.11(B7)  [project net BUS_7]
OUT_8: U40.18(B0)  [project net BUS_8]
OUT_9: U40.17(B1)  [project net BUS_9]
OUT_10: U40.16(B2)  [project net BUS_10]
OUT_11: U40.15(B3)  [project net BUS_11]
OUT_12: U40.14(B4)  [project net BUS_12]
OUT_13: U40.13(B5)  [project net BUS_13]
OUT_14: U40.12(B6)  [project net BUS_14]
OUT_15: U40.11(B7)  [project net BUS_15]
REG_0: U39.2(A0) U41.3(Y)
REG_1: U39.3(A1) U41.6(Y)
REG_2: U39.4(A2) U41.8(Y)
REG_3: U39.5(A3) U41.11(Y)
REG_4: U39.6(A4) U42.3(Y)
REG_5: U39.7(A5) U42.6(Y)
REG_6: U39.8(A6) U42.8(Y)
REG_7: U39.9(A7) U42.11(Y)
REG_8: U40.2(A0) U43.3(Y)
REG_9: U40.3(A1) U43.6(Y)
REG_10: U40.4(A2) U43.8(Y)
REG_11: U40.5(A3) U43.11(Y)
REG_12: U40.6(A4) U44.3(Y)
REG_13: U40.7(A5) U44.6(Y)
REG_14: U40.8(A6) U44.8(Y)
REG_15: U40.9(A7) U44.11(Y)

### Buses and harness runs
bus A_[15..0] = port A_[15..0]
bus B_[15..0] = port B_[15..0]
bus OUT_[15..0] = port OUT_[15..0]

### Notes on the sheet
- Let's Build Rocket's Inc. Modular Paylaod System Based on TMP-010 Rev
  For more information visit https://github.com/LetsBuildRockets/Modular-Payload-System
  This work is licensed under CC BY-NC 4.0. To view a copy of this license, visit https://creativecommons.org/licenses/by-nc/4.0
- Title
- Size:
- Date:
- Assembly Variant:
- B
- Number:
- Time:
- Revision:
- Sheet
- of
- Author:
- File:

### Library data of the parts
U39 U40 = SN74LS245N: as U17 on sheet Accumulator_Register; Published: 8-Jun-2000; LatestRevisionDate: 04-Mar-2005; LatestRevisionNote: Stylized 3D Model Added.; DatasheetVersion: Mar-1988; PackageVersion: Oct-1995; PackageReference: N020; Publisher: Altium Limited; PackageDescription: DIP; 20 Leads; Row Spacing 7.62 mm; Pitch 2.54 mm; ComponentLink1Description: Manufacturer Link; ComponentLink1URL: http://www.ti.com/; ComponentLink2Description: Datasheet; ComponentLink2URL: http://www-s.ti.com/sc/ds/sn74ls245.pdf
U41-U44 = SN74LS32N: Quadruple 2-Input Positive-OR Gate; Published: 8-Jun-2000; LatestRevisionDate: 04-Mar-2005; LatestRevisionNote: Stylized 3D Model Added.; DatasheetVersion: Mar-1988; PackageVersion: Oct-1995; PackageReference: N014; Publisher: Altium Limited; PackageDescription: DIP; 14 Leads; Row Spacing 7.62 mm; Pitch 2.54 mm; ComponentLink1Description: Manufacturer Link; ComponentLink1URL: http://www.ti.com/; ComponentLink2Description: Datasheet; ComponentLink2URL: http://www-s.ti.com/sc/ds/sn74ls32.pdf

## Sheet ALU_XOR.SchDoc
size B; Author: E. Sims; Organization: Let's Build Rockets Inc.; SheetNumber: 14; SheetTotal: 16
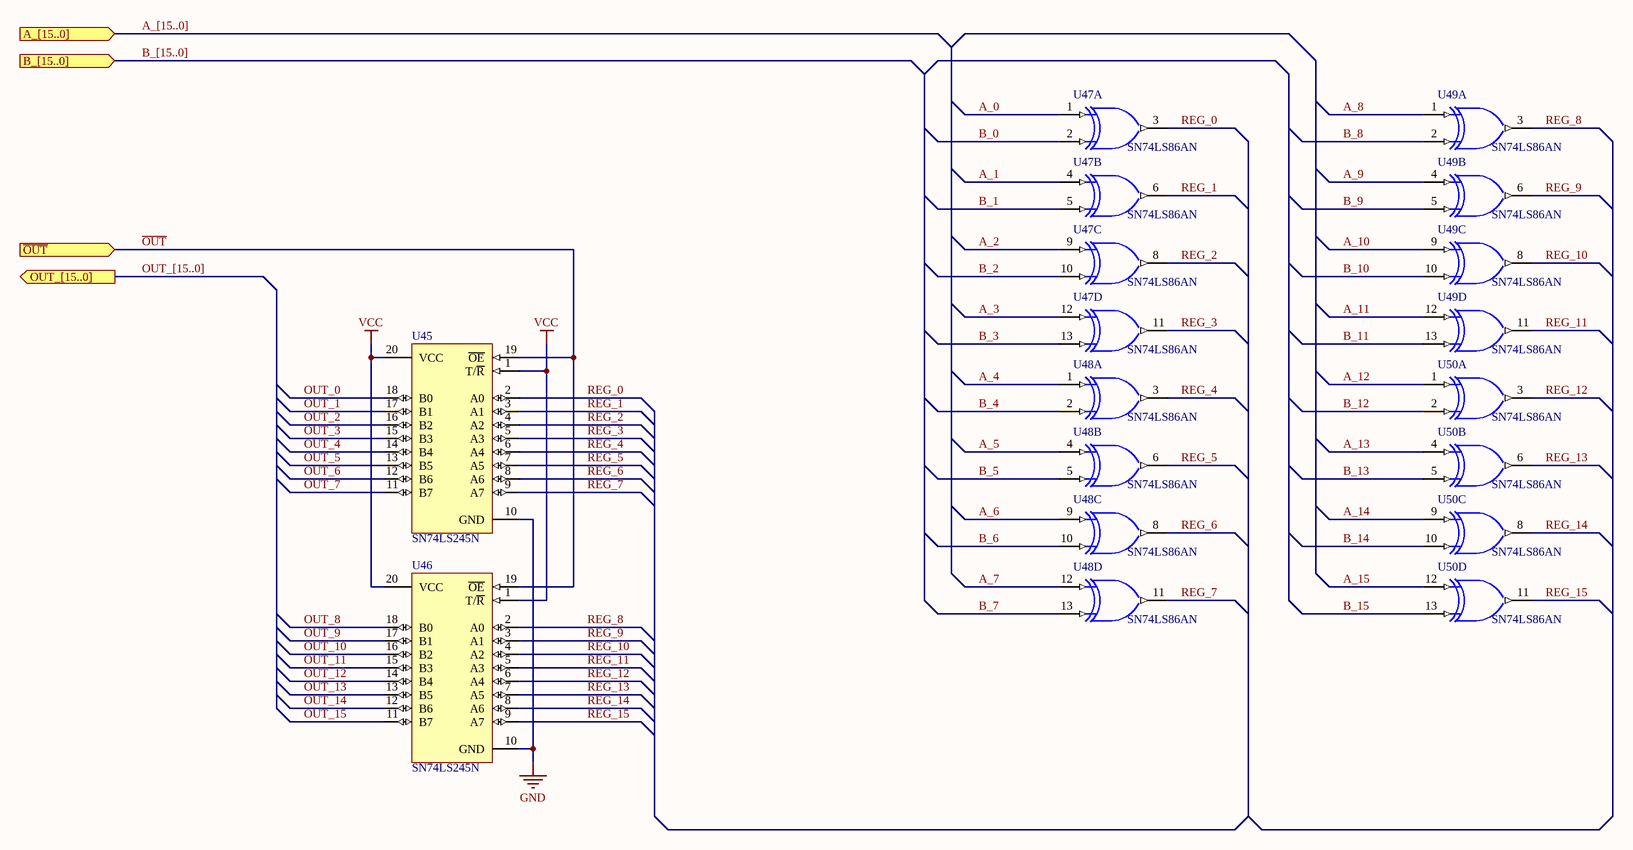
[diagram p6: ALU_XOR.SchDoc]

### Parts
U45  SN74LS245N  [N020]
U46  SN74LS245N  [N020]
U47  SN74LS86AN  [N014]  (parts A,B,C,D of 4)
U48  SN74LS86AN  [N014]  (parts A,B,C,D of 4)
U49  SN74LS86AN  [N014]  (parts A,B,C,D of 4)
U50  SN74LS86AN  [N014]  (parts A,B,C,D of 4)

### Ports
A_[15..0] (in), B_[15..0] (in), OUT_[15..0] (out), ~{OUT} (in)

### Nets
GND: U45.10(GND) U46.10(GND) U47.7(GND) U48.7(GND) U49.7(GND) U50.7(GND)
VCC: U45.1(T/~{R}) U45.20(VCC) U46.1(T/~{R}) U46.20(VCC) U47.14(VCC) U48.14(VCC) U49.14(VCC) U50.14(VCC)
A_0: U47.1(A)
A_1: U47.4(A)
A_2: U47.9(A)
A_3: U47.12(A)
A_4: U48.1(A)
A_5: U48.4(A)
A_6: U48.9(A)
A_7: U48.12(A)
A_8: U49.1(A)
A_9: U49.4(A)
A_10: U49.9(A)
A_11: U49.12(A)
A_12: U50.1(A)
A_13: U50.4(A)
A_14: U50.9(A)
A_15: U50.12(A)
B_0: U47.2(B)
B_1: U47.5(B)
B_2: U47.10(B)
B_3: U47.13(B)
B_4: U48.2(B)
B_5: U48.5(B)
B_6: U48.10(B)
B_7: U48.13(B)
B_8: U49.2(B)
B_9: U49.5(B)
B_10: U49.10(B)
B_11: U49.13(B)
B_12: U50.2(B)
B_13: U50.5(B)
B_14: U50.10(B)
B_15: U50.13(B)
~{OUT}: U45.19(~{OE}) U46.19(~{OE}) ; port ~{OUT}
OUT_0: U45.18(B0)  [project net BUS_0]
OUT_1: U45.17(B1)  [project net BUS_1]
OUT_2: U45.16(B2)  [project net BUS_2]
OUT_3: U45.15(B3)  [project net BUS_3]
OUT_4: U45.14(B4)  [project net BUS_4]
OUT_5: U45.13(B5)  [project net BUS_5]
OUT_6: U45.12(B6)  [project net BUS_6]
OUT_7: U45.11(B7)  [project net BUS_7]
OUT_8: U46.18(B0)  [project net BUS_8]
OUT_9: U46.17(B1)  [project net BUS_9]
OUT_10: U46.16(B2)  [project net BUS_10]
OUT_11: U46.15(B3)  [project net BUS_11]
OUT_12: U46.14(B4)  [project net BUS_12]
OUT_13: U46.13(B5)  [project net BUS_13]
OUT_14: U46.12(B6)  [project net BUS_14]
OUT_15: U46.11(B7)  [project net BUS_15]
REG_0: U45.2(A0) U47.3(Y)
REG_1: U45.3(A1) U47.6(Y)
REG_2: U45.4(A2) U47.8(Y)
REG_3: U45.5(A3) U47.11(Y)
REG_4: U45.6(A4) U48.3(Y)
REG_5: U45.7(A5) U48.6(Y)
REG_6: U45.8(A6) U48.8(Y)
REG_7: U45.9(A7) U48.11(Y)
REG_8: U46.2(A0) U49.3(Y)
REG_9: U46.3(A1) U49.6(Y)
REG_10: U46.4(A2) U49.8(Y)
REG_11: U46.5(A3) U49.11(Y)
REG_12: U46.6(A4) U50.3(Y)
REG_13: U46.7(A5) U50.6(Y)
REG_14: U46.8(A6) U50.8(Y)
REG_15: U46.9(A7) U50.11(Y)

### Buses and harness runs
bus A_[15..0] = port A_[15..0]
bus B_[15..0] = port B_[15..0]
bus OUT_[15..0] = port OUT_[15..0]

### Notes on the sheet
- Let's Build Rocket's Inc. Modular Paylaod System Based on TMP-010 Rev
  For more information visit https://github.com/LetsBuildRockets/Modular-Payload-System
  This work is licensed under CC BY-NC 4.0. To view a copy of this license, visit https://creativecommons.org/licenses/by-nc/4.0
- Title
- Size:
- Date:
- Assembly Variant:
- B
- Number:
- Time:
- Revision:
- Sheet
- of
- Author:
- File:

### Library data of the parts
U45 U46 = SN74LS245N: as U17 on sheet Accumulator_Register; Published: 8-Jun-2000; LatestRevisionDate: 04-Mar-2005; LatestRevisionNote: Stylized 3D Model Added.; DatasheetVersion: Mar-1988; PackageVersion: Oct-1995; PackageReference: N020; Publisher: Altium Limited; PackageDescription: DIP; 20 Leads; Row Spacing 7.62 mm; Pitch 2.54 mm; ComponentLink1Description: Manufacturer Link; ComponentLink1URL: http://www.ti.com/; ComponentLink2Description: Datasheet; ComponentLink2URL: http://www-s.ti.com/sc/ds/sn74ls245.pdf
U47-U50 = SN74LS86AN: Quadruple 2-Input Exclusive-OR Gate; Published: 8-Jun-2000; LatestRevisionDate: 04-Mar-2005; LatestRevisionNote: Stylized 3D Model Added.; DatasheetVersion: Mar-1988; PackageVersion: Oct-1995; PackageReference: N014; Publisher: Altium Limited; PackageDescription: DIP; 14 Leads; Row Spacing 7.62 mm; Pitch 2.54 mm; ComponentLink1Description: Manufacturer Link; ComponentLink1URL: http://www.ti.com/; ComponentLink2Description: Datasheet; ComponentLink2URL: http://www-s.ti.com/sc/ds/sn74ls86a.pdf

## Sheet ALU_Shifter.SchDoc
size B; Author: E. Sims; Organization: Let's Build Rockets Inc.; SheetNumber: 15; SheetTotal: 16
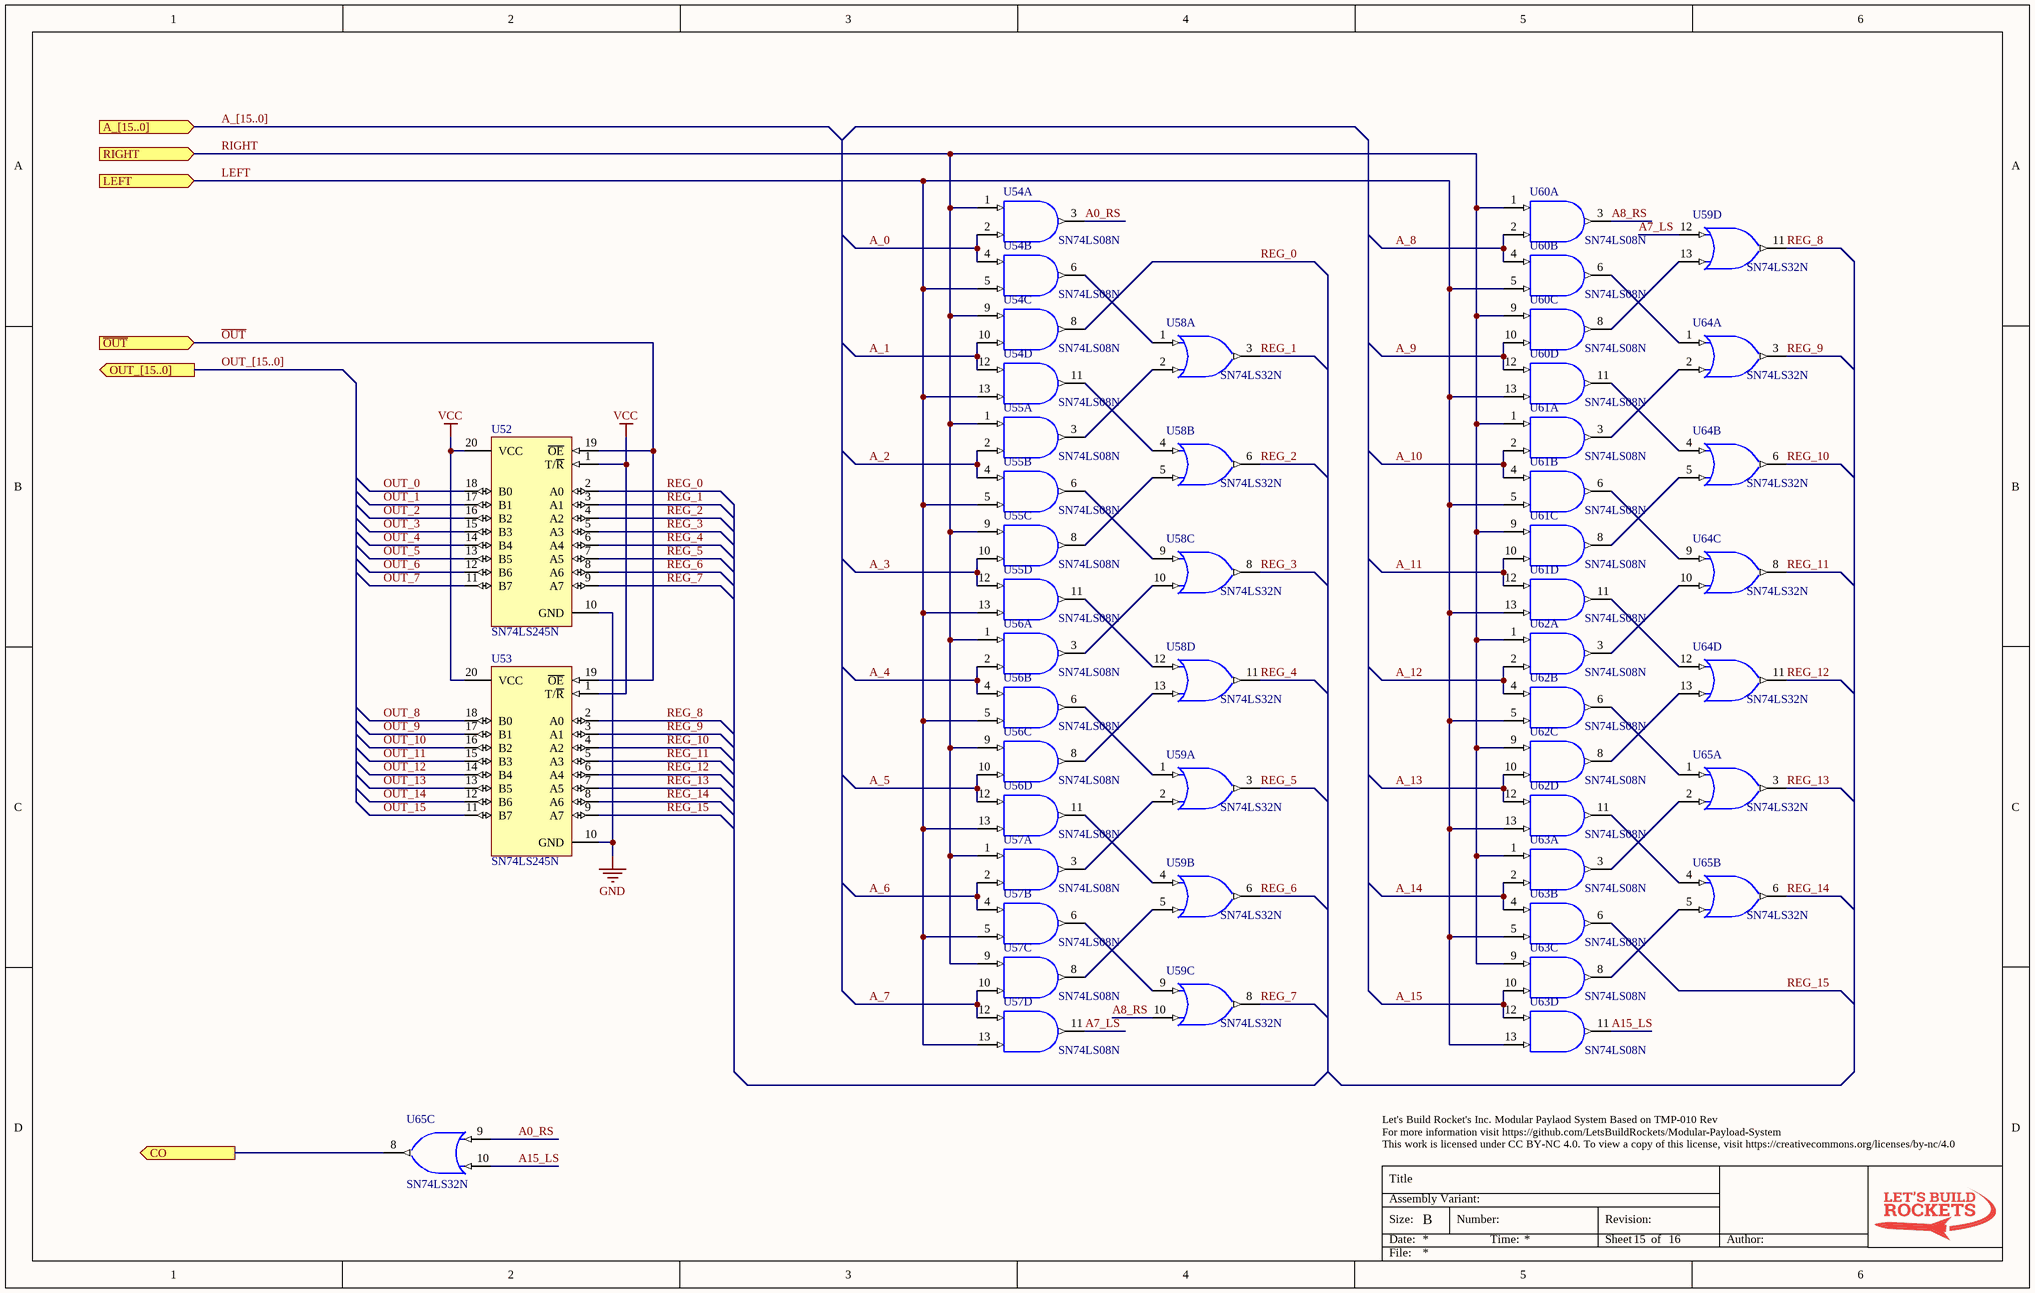
[diagram p7: ALU_Shifter.SchDoc]

### Parts
U52  SN74LS245N  [N020]
U53  SN74LS245N  [N020]
U54  SN74LS08N  [N014]  (parts A,B,C,D of 4)
U55  SN74LS08N  [N014]  (parts A,B,C,D of 4)
U56  SN74LS08N  [N014]  (parts A,B,C,D of 4)
U57  SN74LS08N  [N014]  (parts A,B,C,D of 4)
U58  SN74LS32N  [N014]  (parts A,B,C,D of 4)
U59  SN74LS32N  [N014]  (parts A,B,C,D of 4)
U60  SN74LS08N  [N014]  (parts A,B,C,D of 4)
U61  SN74LS08N  [N014]  (parts A,B,C,D of 4)
U62  SN74LS08N  [N014]  (parts A,B,C,D of 4)
U63  SN74LS08N  [N014]  (parts A,B,C,D of 4)
U64  SN74LS32N  [N014]  (parts A,B,C,D of 4)
U65  SN74LS32N  [N014]  (parts A,B,C of 4)

### Ports
A_[15..0] (in), CO (out), LEFT (in), OUT_[15..0] (out), RIGHT (in), ~{OUT} (in)

### Nets
GND: U52.10(GND) U53.10(GND) U54.7(GND) U55.7(GND) U56.7(GND) U57.7(GND) U58.7(GND) U59.7(GND) U60.7(GND) U61.7(GND) U62.7(GND) U63.7(GND) U64.7(GND) U65.7(GND)
VCC: U52.1(T/~{R}) U52.20(VCC) U53.1(T/~{R}) U53.20(VCC) U54.14(VCC) U55.14(VCC) U56.14(VCC) U57.14(VCC) U58.14(VCC) U59.14(VCC) U60.14(VCC) U61.14(VCC) U62.14(VCC) U63.14(VCC) U64.14(VCC) U65.14(VCC)
A0_RS: U54.3(Y) U65.9(A)
A7_LS: U57.11(Y) U59.12(A)
A8_RS: U59.10(B) U60.3(Y)
A15_LS: U63.11(Y) U65.10(B)
A_0: U54.2(B) U54.4(A)
A_1: U54.10(B) U54.12(A)
A_2: U55.2(B) U55.4(A)
A_3: U55.10(B) U55.12(A)
A_4: U56.2(B) U56.4(A)
A_5: U56.10(B) U56.12(A)
A_6: U57.2(B) U57.4(A)
A_7: U57.10(B) U57.12(A)
A_8: U60.2(B) U60.4(A)
A_9: U60.10(B) U60.12(A)
A_10: U61.2(B) U61.4(A)
A_11: U61.10(B) U61.12(A)
A_12: U62.2(B) U62.4(A)
A_13: U62.10(B) U62.12(A)
A_14: U63.2(B) U63.4(A)
A_15: U63.10(B) U63.12(A)
LEFT: U54.5(B) U54.13(B) U55.5(B) U55.13(B) U56.5(B) U56.13(B) U57.5(B) U57.13(B) U60.5(B) U60.13(B) U61.5(B) U61.13(B) U62.5(B) U62.13(B) U63.5(B) U63.13(B) ; port LEFT
~{OUT}: U52.19(~{OE}) U53.19(~{OE}) ; port ~{OUT}
OUT_0: U52.18(B0)  [project net BUS_0]
OUT_1: U52.17(B1)  [project net BUS_1]
OUT_2: U52.16(B2)  [project net BUS_2]
OUT_3: U52.15(B3)  [project net BUS_3]
OUT_4: U52.14(B4)  [project net BUS_4]
OUT_5: U52.13(B5)  [project net BUS_5]
OUT_6: U52.12(B6)  [project net BUS_6]
OUT_7: U52.11(B7)  [project net BUS_7]
OUT_8: U53.18(B0)  [project net BUS_8]
OUT_9: U53.17(B1)  [project net BUS_9]
OUT_10: U53.16(B2)  [project net BUS_10]
OUT_11: U53.15(B3)  [project net BUS_11]
OUT_12: U53.14(B4)  [project net BUS_12]
OUT_13: U53.13(B5)  [project net BUS_13]
OUT_14: U53.12(B6)  [project net BUS_14]
OUT_15: U53.11(B7)  [project net BUS_15]
REG_0: U52.2(A0) U54.8(Y)
REG_1: U52.3(A1) U58.3(Y)
REG_2: U52.4(A2) U58.6(Y)
REG_3: U52.5(A3) U58.8(Y)
REG_4: U52.6(A4) U58.11(Y)
REG_5: U52.7(A5) U59.3(Y)
REG_6: U52.8(A6) U59.6(Y)
REG_7: U52.9(A7) U59.8(Y)
REG_8: U53.2(A0) U59.11(Y)
REG_9: U53.3(A1) U64.3(Y)
REG_10: U53.4(A2) U64.6(Y)
REG_11: U53.5(A3) U64.8(Y)
REG_12: U53.6(A4) U64.11(Y)
REG_13: U53.7(A5) U65.3(Y)
REG_14: U53.8(A6) U65.6(Y)
REG_15: U53.9(A7) U63.6(Y)
RIGHT: U54.1(A) U54.9(A) U55.1(A) U55.9(A) U56.1(A) U56.9(A) U57.1(A) U57.9(A) U60.1(A) U60.9(A) U61.1(A) U61.9(A) U62.1(A) U62.9(A) U63.1(A) U63.9(A) ; port RIGHT
NetU54_6: U54.6(Y) U58.1(A)
NetU54_11: U54.11(Y) U58.4(A)
NetU55_3: U55.3(Y) U58.2(B)
NetU55_6: U55.6(Y) U58.9(A)
NetU55_8: U55.8(Y) U58.5(B)
NetU55_11: U55.11(Y) U58.12(A)
NetU56_3: U56.3(Y) U58.10(B)
NetU56_6: U56.6(Y) U59.1(A)
NetU56_8: U56.8(Y) U58.13(B)
NetU56_11: U56.11(Y) U59.4(A)
NetU57_3: U57.3(Y) U59.2(B)
NetU57_6: U57.6(Y) U59.9(A)
NetU57_8: U57.8(Y) U59.5(B)
NetU59_13: U59.13(B) U60.8(Y)
NetU60_6: U60.6(Y) U64.1(A)
NetU60_11: U60.11(Y) U64.4(A)
NetU61_3: U61.3(Y) U64.2(B)
NetU61_6: U61.6(Y) U64.9(A)
NetU61_8: U61.8(Y) U64.5(B)
NetU61_11: U61.11(Y) U64.12(A)
NetU62_3: U62.3(Y) U64.10(B)
NetU62_6: U62.6(Y) U65.1(A)
NetU62_8: U62.8(Y) U64.13(B)
NetU62_11: U62.11(Y) U65.4(A)
NetU63_3: U63.3(Y) U65.2(B)
NetU63_8: U63.8(Y) U65.5(B)
NetU65_8: U65.8(Y) ; port CO

### Buses and harness runs
bus A_[15..0] = port A_[15..0]
bus OUT_[15..0] = port OUT_[15..0]

### Notes on the sheet
- Let's Build Rocket's Inc. Modular Paylaod System Based on TMP-010 Rev
  For more information visit https://github.com/LetsBuildRockets/Modular-Payload-System
  This work is licensed under CC BY-NC 4.0. To view a copy of this license, visit https://creativecommons.org/licenses/by-nc/4.0
- Title
- Size:
- Date:
- Assembly Variant:
- B
- Number:
- Time:
- Revision:
- Sheet
- of
- Author:
- File:

### Library data of the parts
U52 U53 = SN74LS245N: as U17 on sheet Accumulator_Register; Published: 8-Jun-2000; LatestRevisionDate: 04-Mar-2005; LatestRevisionNote: Stylized 3D Model Added.; DatasheetVersion: Mar-1988; PackageVersion: Oct-1995; PackageReference: N020; Publisher: Altium Limited; PackageDescription: DIP; 20 Leads; Row Spacing 7.62 mm; Pitch 2.54 mm; ComponentLink1Description: Manufacturer Link; ComponentLink1URL: http://www.ti.com/; ComponentLink2Description: Datasheet; ComponentLink2URL: http://www-s.ti.com/sc/ds/sn74ls245.pdf
U54-U57 U60-U63 = SN74LS08N: Quadruple 2-Input Positive-AND Gate; Published: 8-Jun-2000; LatestRevisionDate: 04-Mar-2005; LatestRevisionNote: Stylized 3D Model Added.; DatasheetVersion: Mar-1988; PackageVersion: Oct-1995; PackageReference: N014; Publisher: Altium Limited; PackageDescription: DIP; 14 Leads; Row Spacing 7.62 mm; Pitch 2.54 mm; ComponentLink1Description: Manufacturer Link; ComponentLink1URL: http://www.ti.com/; ComponentLink2Description: Datasheet; ComponentLink2URL: http://www-s.ti.com/sc/ds/SN74LS08.pdf
U58 U59 U64 U65 = SN74LS32N: Quadruple 2-Input Positive-OR Gate; Published: 8-Jun-2000; LatestRevisionDate: 04-Mar-2005; LatestRevisionNote: Stylized 3D Model Added.; DatasheetVersion: Mar-1988; PackageVersion: Oct-1995; PackageReference: N014; Publisher: Altium Limited; PackageDescription: DIP; 14 Leads; Row Spacing 7.62 mm; Pitch 2.54 mm; ComponentLink1Description: Manufacturer Link; ComponentLink1URL: http://www.ti.com/; ComponentLink2Description: Datasheet; ComponentLink2URL: http://www-s.ti.com/sc/ds/sn74ls32.pdf

## Sheet ALU_ZF.SchDoc
size B; Author: E. Sims; Organization: Let's Build Rockets Inc.; SheetNumber: 16; SheetTotal: 16
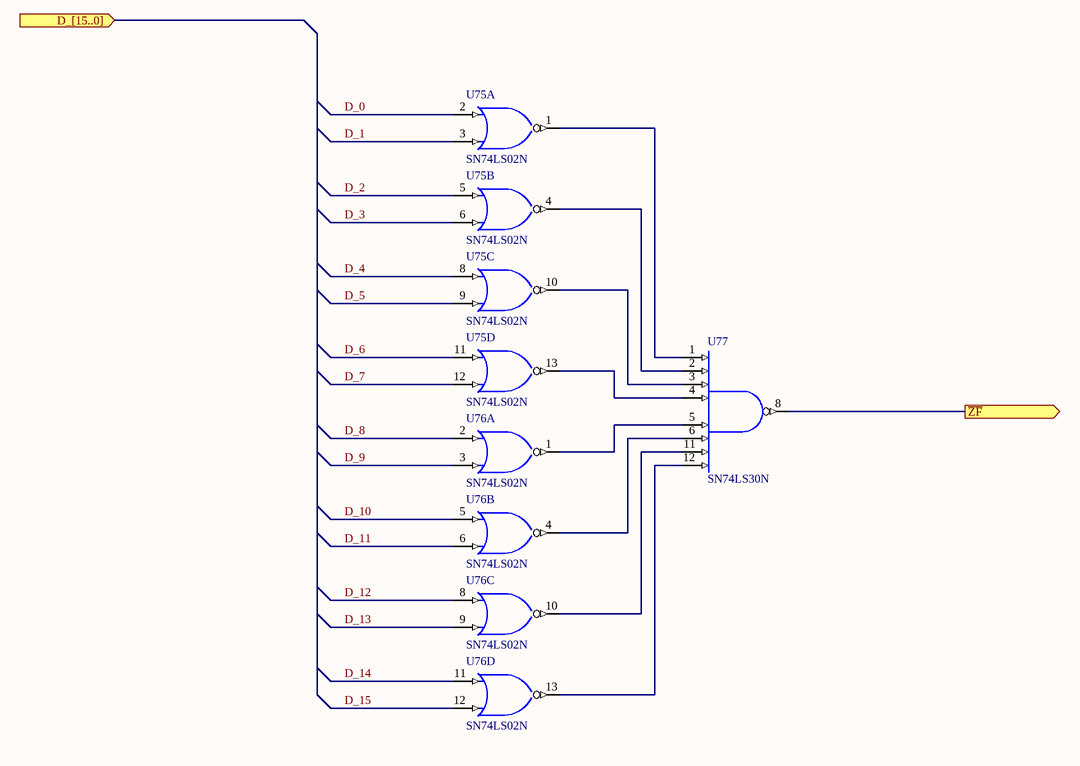
[diagram p8: ALU_ZF.SchDoc]

### Parts
U75  SN74LS02N  [N014]  (parts A,B,C,D of 4)
U76  SN74LS02N  [N014]  (parts A,B,C,D of 4)
U77  SN74LS30N  [N014]

### Ports
D_[15..0] (in), ~{ZF} (out)

### Nets
GND: U75.7(GND) U76.7(GND) U77.7(GND)
VCC: U75.14(VCC) U76.14(VCC) U77.14(VCC)
D_0: U75.2(A)
D_1: U75.3(B)
D_2: U75.5(A)
D_3: U75.6(B)
D_4: U75.8(A)
D_5: U75.9(B)
D_6: U75.11(A)
D_7: U75.12(B)
D_8: U76.2(A)
D_9: U76.3(B)
D_10: U76.5(A)
D_11: U76.6(B)
D_12: U76.8(A)
D_13: U76.9(B)
D_14: U76.11(A)
D_15: U76.12(B)
NetU25#2_1: U77.8(Y) ; port ~{ZF}
NetU75_1: U75.1(Y) U77.1(A)
NetU75_4: U75.4(Y) U77.2(B)
NetU75_10: U75.10(Y) U77.3(C)
NetU75_13: U75.13(Y) U77.4(D)
NetU76_1: U76.1(Y) U77.5(E)
NetU76_4: U76.4(Y) U77.6(F)
NetU76_10: U76.10(Y) U77.11(G)
NetU76_13: U76.13(Y) U77.12(H)

### Library data of the parts
U75 U76 = SN74LS02N: Quadruple 2-Input Positive-NOR Gate; Published: 8-Jun-2000; LatestRevisionDate: 04-Mar-2005; LatestRevisionNote: Stylized 3D Model Added.; DatasheetVersion: Mar-1988; PackageVersion: Oct-1995; PackageReference: N014; Publisher: Altium Limited; PackageDescription: DIP; 14 Leads; Row Spacing 7.62 mm; Pitch 2.54 mm; ComponentLink1Description: Manufacturer Link; ComponentLink1URL: http://www.ti.com/; ComponentLink2Description: Datasheet; ComponentLink2URL: http://www-s.ti.com/sc/ds/sn54s02.pdf
U77 = SN74LS30N: 8-Input Positive-NAND Gate; Note: Pins 9, 10  and 13 are NC & not drawn.; Published: 8-Jun-2000; LatestRevisionDate: 04-Mar-2005; LatestRevisionNote: Stylized 3D Model Added.; DatasheetVersion: Mar-1988; PackageVersion: Oct-1995; PackageReference: N014; Publisher: Altium Limited; PackageDescription: DIP; 14 Leads; Row Spacing 7.62 mm; Pitch 2.54 mm; ComponentLink1Description: Manufacturer Link; ComponentLink1URL: http://www.ti.com/; ComponentLink2Description: Datasheet; ComponentLink2URL: http://www-s.ti.com/sc/ds/sn74s30.pdf

## Sheet ALU_ONES.SchDoc
size B; Author: E. Sims; Organization: Let's Build Rockets Inc.; SheetNumber: 17; SheetTotal: 17
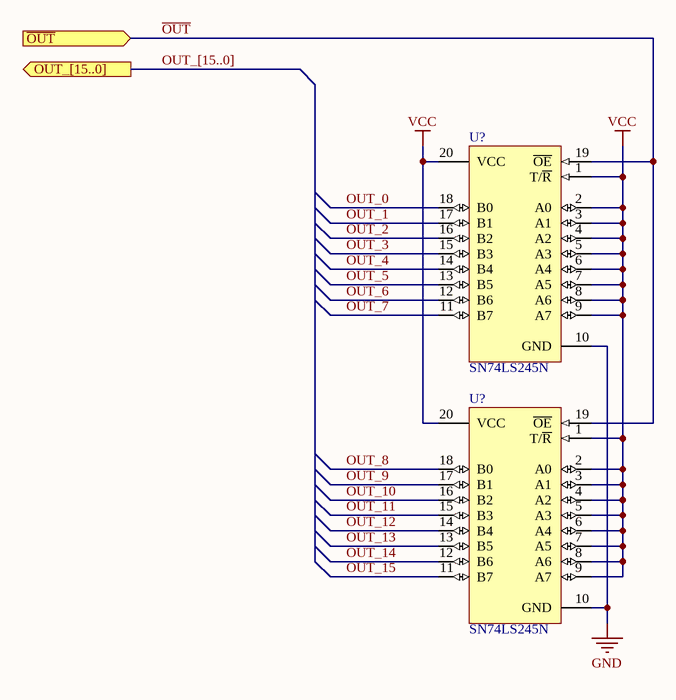
[diagram p9: ALU_ONES.SchDoc]

### Parts
(Parts that share a designator on the sheet are numbered #1, #2 ... from top to bottom, then left to right.)
U?#1  SN74LS245N  [N020]
U?#2  SN74LS245N  [N020]

### Ports
OUT_[15..0] (out), ~{OUT} (in)

### Nets
GND: U?#1.10(GND) U?#2.10(GND)
VCC: U?#1.1(T/~{R}) U?#1.2(A0) U?#1.3(A1) U?#1.4(A2) U?#1.5(A3) U?#1.6(A4) U?#1.7(A5) U?#1.8(A6) U?#1.9(A7) U?#1.20(VCC) U?#2.1(T/~{R}) U?#2.2(A0) U?#2.3(A1) U?#2.4(A2) U?#2.5(A3) U?#2.6(A4) U?#2.7(A5) U?#2.8(A6) U?#2.9(A7) U?#2.20(VCC)
~{OUT}: U?#1.19(~{OE}) U?#2.19(~{OE}) ; port ~{OUT}  [project net ~{ONES}]
OUT_0: U?#1.18(B0)  [project net BUS_0]
OUT_1: U?#1.17(B1)  [project net BUS_1]
OUT_2: U?#1.16(B2)  [project net BUS_2]
OUT_3: U?#1.15(B3)  [project net BUS_3]
OUT_4: U?#1.14(B4)  [project net BUS_4]
OUT_5: U?#1.13(B5)  [project net BUS_5]
OUT_6: U?#1.12(B6)  [project net BUS_6]
OUT_7: U?#1.11(B7)  [project net BUS_7]
OUT_8: U?#2.18(B0)  [project net BUS_8]
OUT_9: U?#2.17(B1)  [project net BUS_9]
OUT_10: U?#2.16(B2)  [project net BUS_10]
OUT_11: U?#2.15(B3)  [project net BUS_11]
OUT_12: U?#2.14(B4)  [project net BUS_12]
OUT_13: U?#2.13(B5)  [project net BUS_13]
OUT_14: U?#2.12(B6)  [project net BUS_14]
OUT_15: U?#2.11(B7)  [project net BUS_15]

### Buses and harness runs
bus OUT_[15..0] = port OUT_[15..0]

### Notes on the sheet
- Let's Build Rocket's Inc. Modular Paylaod System Based on TMP-010 Rev
  For more information visit https://github.com/LetsBuildRockets/Modular-Payload-System
  This work is licensed under CC BY-NC 4.0. To view a copy of this license, visit https://creativecommons.org/licenses/by-nc/4.0
- Title
- Size:
- Date:
- Assembly Variant:
- B
- Number:
- Time:
- Revision:
- Sheet
- of
- Author:
- File:

### Library data of the parts
U?#1 U?#2 = SN74LS245N: as U17 on sheet Accumulator_Register; Published: 8-Jun-2000; LatestRevisionDate: 04-Mar-2005; LatestRevisionNote: Stylized 3D Model Added.; DatasheetVersion: Mar-1988; PackageVersion: Oct-1995; PackageReference: N020; Publisher: Altium Limited; PackageDescription: DIP; 20 Leads; Row Spacing 7.62 mm; Pitch 2.54 mm; ComponentLink1Description: Manufacturer Link; ComponentLink1URL: http://www.ti.com/; ComponentLink2Description: Datasheet; ComponentLink2URL: http://www-s.ti.com/sc/ds/sn74ls245.pdf

## Sheet Timer_Register.SchDoc
size B; Author: E. Sims; Organization: Let's Build Rockets Inc.; SheetNumber: 9; SheetTotal: 16
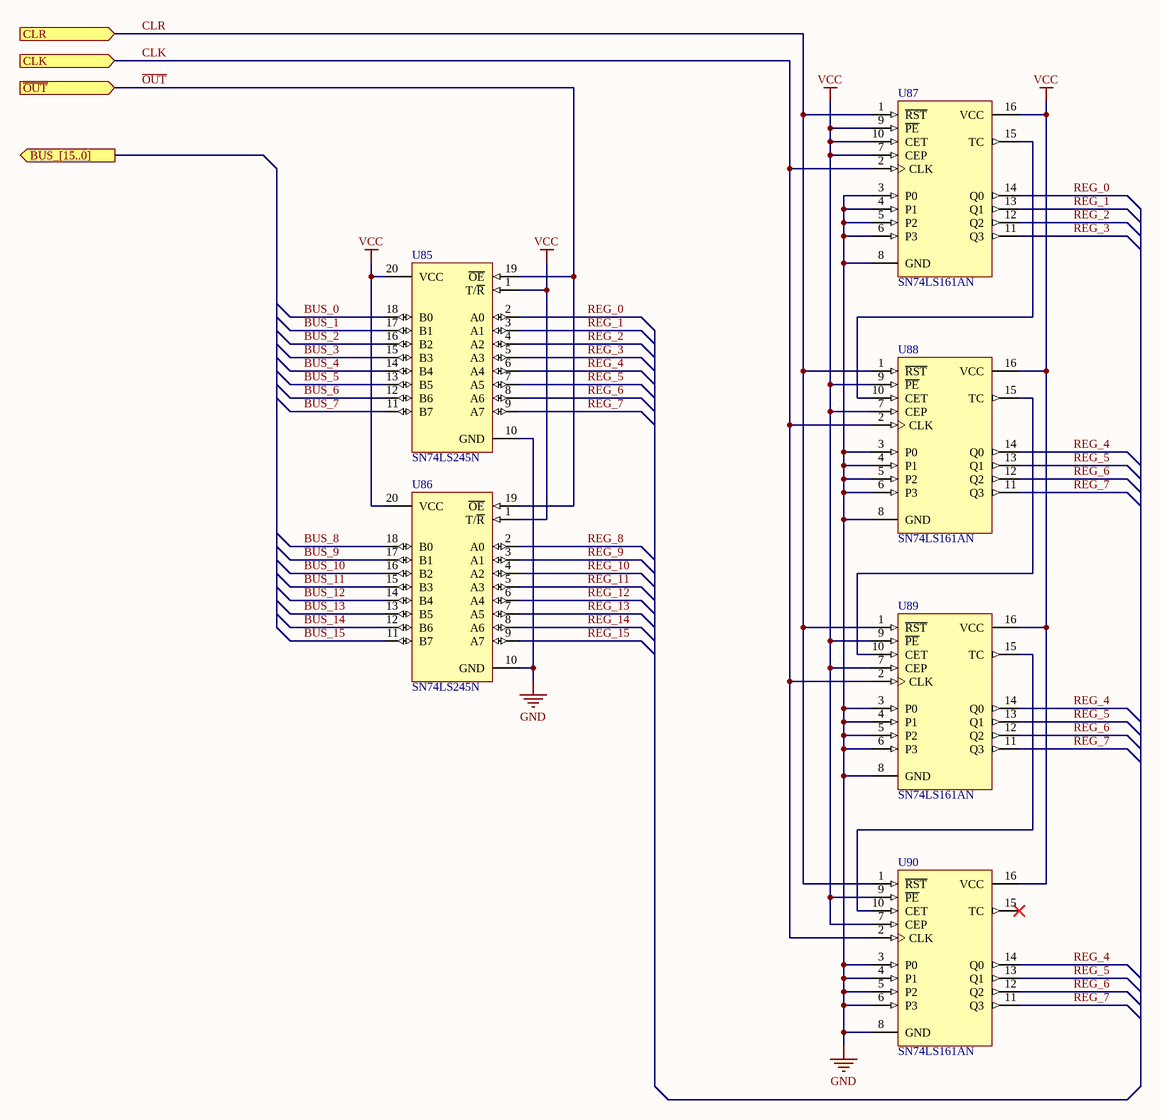
[diagram p10: Timer_Register.SchDoc]

### Parts
U85  SN74LS245N  [N020]
U86  SN74LS245N  [N020]
U87  SN74LS161AN  [N016]
U88  SN74LS161AN  [N016]
U89  SN74LS161AN  [N016]
U90  SN74LS161AN  [N016]

### Ports
BUS_[15..0] (out), CLK (in), CLR (in), ~{OUT} (in)

### Nets
GND: U85.10(GND) U86.10(GND) U87.3(P0) U87.4(P1) U87.5(P2) U87.6(P3) U87.8(GND) U88.3(P0) U88.4(P1) U88.5(P2) U88.6(P3) U88.8(GND) U89.3(P0) U89.4(P1) U89.5(P2) U89.6(P3) U89.8(GND) U90.3(P0) U90.4(P1) U90.5(P2) U90.6(P3) U90.8(GND)
VCC: U85.1(T/~{R}) U85.20(VCC) U86.1(T/~{R}) U86.20(VCC) U87.7(CEP) U87.9(~{PE}) U87.10(CET) U87.16(VCC) U88.7(CEP) U88.9(~{PE}) U88.16(VCC) U89.7(CEP) U89.9(~{PE}) U89.16(VCC) U90.7(CEP) U90.9(~{PE}) U90.16(VCC)
BUS_0: U85.18(B0)
BUS_1: U85.17(B1)
BUS_2: U85.16(B2)
BUS_3: U85.15(B3)
BUS_4: U85.14(B4)
BUS_5: U85.13(B5)
BUS_6: U85.12(B6)
BUS_7: U85.11(B7)
BUS_8: U86.18(B0)
BUS_9: U86.17(B1)
BUS_10: U86.16(B2)
BUS_11: U86.15(B3)
BUS_12: U86.14(B4)
BUS_13: U86.13(B5)
BUS_14: U86.12(B6)
BUS_15: U86.11(B7)
CLK: U87.2(CLK) U88.2(CLK) U89.2(CLK) U90.2(CLK) ; port CLK
CLR: U87.1(~{RST}) U88.1(~{RST}) U89.1(~{RST}) U90.1(~{RST}) ; port CLR
~{OUT}: U85.19(~{OE}) U86.19(~{OE}) ; port ~{OUT}
REG_0: U85.2(A0) U87.14(Q0)
REG_1: U85.3(A1) U87.13(Q1)
REG_2: U85.4(A2) U87.12(Q2)
REG_3: U85.5(A3) U87.11(Q3)
REG_4: U85.6(A4) U88.14(Q0) U89.14(Q0) U90.14(Q0)
REG_5: U85.7(A5) U88.13(Q1) U89.13(Q1) U90.13(Q1)
REG_6: U85.8(A6) U88.12(Q2) U89.12(Q2) U90.12(Q2)
REG_7: U85.9(A7) U88.11(Q3) U89.11(Q3) U90.11(Q3)
REG_8: U86.2(A0)
REG_9: U86.3(A1)
REG_10: U86.4(A2)
REG_11: U86.5(A3)
REG_12: U86.6(A4)
REG_13: U86.7(A5)
REG_14: U86.8(A6)
REG_15: U86.9(A7)
NetU87_15: U87.15(TC) U88.10(CET)
NetU88_15: U88.15(TC) U89.10(CET)
NetU89_15: U89.15(TC) U90.10(CET)

Not connected (* = marked no-connect by the designer): U90 15(TC)*

### Notes on the sheet
- Let's Build Rocket's Inc. Modular Paylaod System Based on TMP-010 Rev
  For more information visit https://github.com/LetsBuildRockets/Modular-Payload-System
  This work is licensed under CC BY-NC 4.0. To view a copy of this license, visit https://creativecommons.org/licenses/by-nc/4.0
- Title
- Size:
- Date:
- Assembly Variant:
- B
- Number:
- Time:
- Revision:
- Sheet
- of
- Author:
- File:

### Library data of the parts
U85 U86 = SN74LS245N: as U17 on sheet Accumulator_Register; Published: 8-Jun-2000; LatestRevisionDate: 04-Mar-2005; LatestRevisionNote: Stylized 3D Model Added.; DatasheetVersion: Mar-1988; PackageVersion: Oct-1995; PackageReference: N020; Publisher: Altium Limited; PackageDescription: DIP; 20 Leads; Row Spacing 7.62 mm; Pitch 2.54 mm; ComponentLink1Description: Manufacturer Link; ComponentLink1URL: http://www.ti.com/; ComponentLink2Description: Datasheet; ComponentLink2URL: http://www-s.ti.com/sc/ds/sn74ls245.pdf
U87-U90 = SN74LS161AN: Synchronous 4-Bit Counter; Published: 8-Jun-2000; LatestRevisionDate: 04-Mar-2005; LatestRevisionNote: Stylized 3D Model Added.; DatasheetVersion: Mar-1988; PackageVersion: Oct-1995; PackageReference: N016; Publisher: Altium Limited; PackageDescription: DIP; 16 Leads; Row Spacing 7.62 mm; Pitch 2.54 mm; Code_JEDEC: MS-001-BB; ComponentLink1Description: Manufacturer Link; ComponentLink1URL: http://www.ti.com/; ComponentLink2Description: Datasheet; ComponentLink2URL: http://www-s.ti.com/sc/ds/sn74ls161a.pdf; ComponentLink3Description: URL Link1; ComponentLink3URL: http://focus.ti.com/docs/prod/folders/print/sn74ls161a.html